# EAGLE schematic LabFriendMain1 (EAGLE 7.7.0), part 1 of 2

## Sheet 1 of 13: Config, Iso...
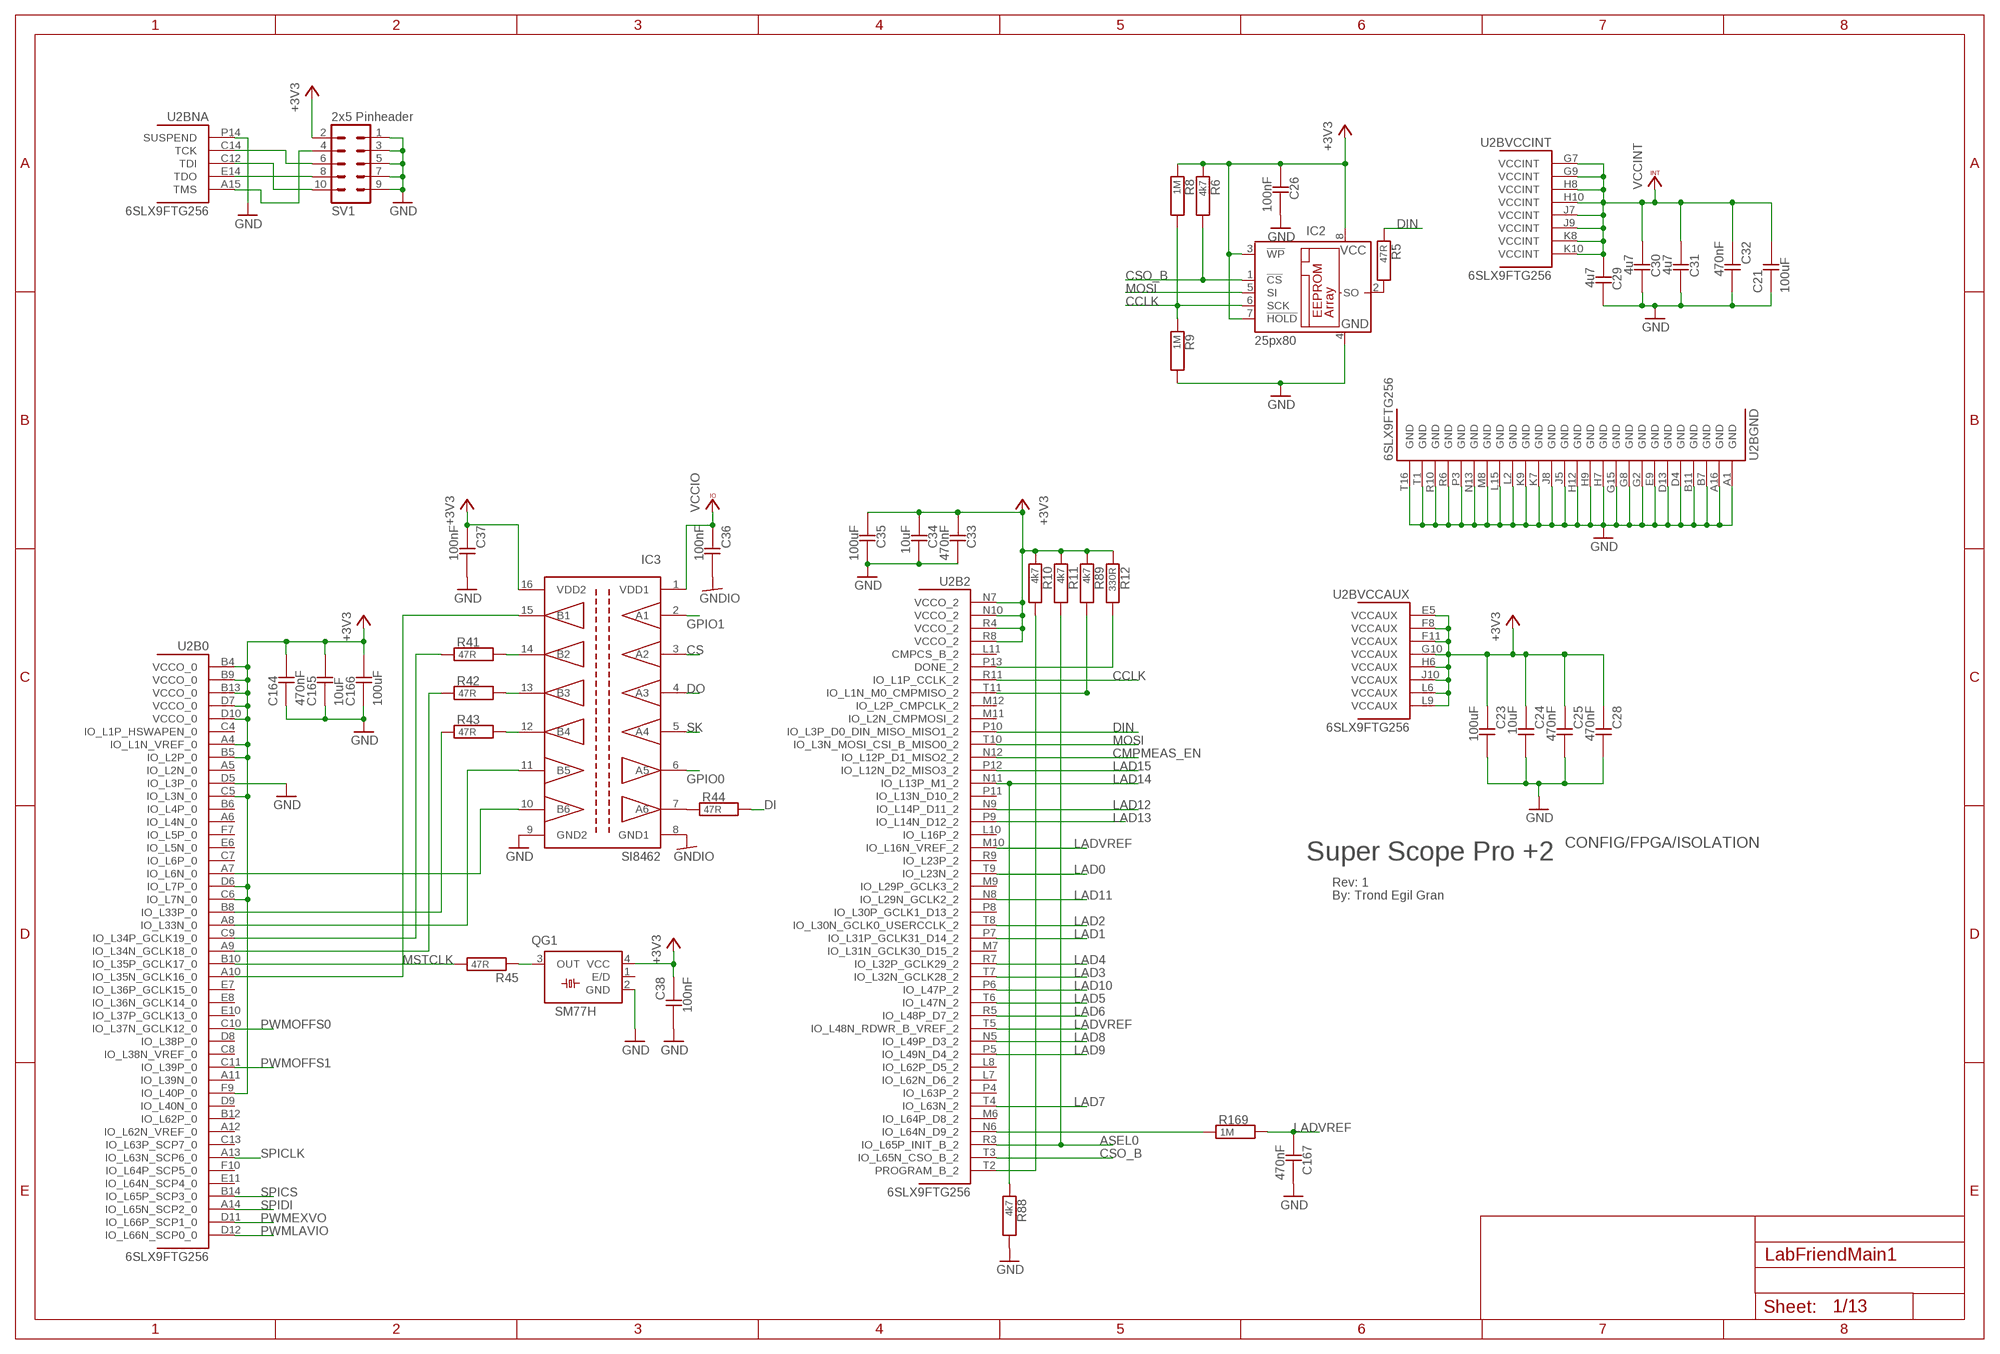
[diagram p0: schematic, sheet 1]

### Parts
C21  100uF  CAPC1206  [1206]
C23  100uF  CAPC1206  [1206]
C24  10uF  CAPC0603  [0603]
C25  470nF  CAPC0402  [0402]
C26  100nF  CAPC0402  [0402]
C28  470nF  CAPC0402  [0402]
C29  4u7  CAPC0603  [0603]
C30  4u7  CAPC0603  [0603]
C31  4u7  CAPC0603  [0603]
C32  470nF  CAPC0402  [0402]
C33  470nF  CAPC0402  [0402]
C34  10uF  CAPC0603  [0603]
C35  100uF  CAPC1206  [1206]
C36  100nF  CAPC0402  [0402]
C37  100nF  CAPC0402  [0402]
C38  100nF  CAPC0402  [0402]
C164  470nF  CAPC0402  [0402]
C165  10uF  CAPC0603  [0603]
C166  100uF  CAPC1206  [1206]
C167  470nF  CAPC0402  [0402]
IC2  25px80  25AA080SN  [SO-08]
IC3  SI8462  [SO16]
QG1  SM77H  [SM77H]
R5  47R  RESR0402  [0402]
R6  4k7  RESR0402  [0402]
R8  1M  RESR0402  [0402]
R9  1M  RESR0402  [0402]
R10  4k7  RESR0402  [0402]
R11  4k7  RESR0402  [0402]
R12  330R  RESR0402  [0402]
R41  47R  RESR0402  [0402]
R42  47R  RESR0402  [0402]
R43  47R  RESR0402  [0402]
R44  47R  RESR0402  [0402]
R45  47R  RESR0402  [0402]
R88  4k7  RESR0402  [0402]
R89  4k7  RESR0402  [0402]
R169  1M  RESR0402  [0402]
SV1  2x5 Pinheader  ML10  [ML10]
U2  6SLX9FTG256  [FT256]

### Nets
+3V3: C23.1 C24.1 C25.1 C26.1 C28.1 C33.1 C34.1 C35.1 C37.1 C38.1 C164.2 C165.2 C166.2 IC2.3(!WP) IC2.7(!HOLD) IC2.8(VCC) IC3.16(VDD2) QG1.4(VCC) R6.1 R8.1 R10.1 R11.1 R12.1 R89.1 SV1.2 U2.A4(B0:IO_L1N_VREF_0) U2.B4(B0:VCCO_0) U2.B5(B0:IO_L2P_0) U2.B9(B0:VCCO_0) U2.B13(B0:VCCO_0) U2.C5(B0:IO_L3N_0) U2.C6(B0:IO_L7N_0) U2.D6(B0:IO_L7P_0) U2.D7(B0:VCCO_0) U2.D10(B0:VCCO_0) U2.E5(BVCCAUX:VCCAUX) U2.F8(BVCCAUX:VCCAUX) U2.F9(B0:IO_L40P_0) U2.F11(BVCCAUX:VCCAUX) U2.G10(BVCCAUX:VCCAUX) U2.H6(BVCCAUX:VCCAUX) U2.J10(BVCCAUX:VCCAUX) U2.L6(BVCCAUX:VCCAUX) U2.L9(BVCCAUX:VCCAUX) U2.N7(B2:VCCO_2) U2.N10(B2:VCCO_2) U2.R4(B2:VCCO_2) U2.R8(B2:VCCO_2) ; also sheet 3,5,6,8
ASEL0: R11.2 U2.R3(B2:IO_L65P_INIT_B_2)
CCLK: IC2.6(SCK) R8.2 R9.1 U2.R11(B2:IO_L1P_CCLK_2)
CMPMEAS_EN: U2.N12(B2:IO_L12P_D1_MISO2_2) ; also sheet 9
CS: IC3.3(A2) ; also sheet 4
CSO_B: IC2.1(!CS) R6.2 U2.T3(B2:IO_L65N_CSO_B_2)
DI: R44.2 ; also sheet 4
DIN: R5.1 U2.P10(B2:IO_L3P_D0_DIN_MISO_MISO1_2)
DO: IC3.4(A3) ; also sheet 4
GND: C21.1 C23.2 C24.2 C25.2 C26.2 C28.2 C29.2 C30.2 C31.2 C32.2 C33.2 C34.2 C35.2 C37.2 C38.2 C164.1 C165.1 C166.1 C167.2 IC2.4(GND) IC3.9(GND2) QG1.2(GND) R9.2 R88.2 SV1.1 SV1.3 SV1.5 SV1.7 SV1.9 U2.A1(BGND:GND) U2.A16(BGND:GND) U2.B7(BGND:GND) U2.B11(BGND:GND) U2.D4(BGND:GND) U2.D5(B0:IO_L3P_0) U2.D13(BGND:GND) U2.E9(BGND:GND) U2.G2(BGND:GND) U2.G8(BGND:GND) U2.G15(BGND:GND) U2.H7(BGND:GND) U2.H9(BGND:GND) U2.H12(BGND:GND) U2.J5(BGND:GND) U2.J8(BGND:GND) U2.K7(BGND:GND) U2.K9(BGND:GND) U2.L2(BGND:GND) U2.L15(BGND:GND) U2.M8(BGND:GND) U2.N13(BGND:GND) U2.P3(BGND:GND) U2.P14(BNA:SUSPEND) U2.R6(BGND:GND) U2.R10(BGND:GND) U2.T1(BGND:GND) U2.T16(BGND:GND) ; also sheet 2,3,5,6,7,8,9,10,11,12,13
GNDIO: C36.2 IC3.8(GND1) ; also sheet 4,10
GPIO0: IC3.6(A5) ; also sheet 4
GPIO1: IC3.2(A1) ; also sheet 4
LAD0: U2.T9(B2:IO_L23N_2) ; also sheet 5
LAD1: U2.P7(B2:IO_L31P_GCLK31_D14_2) ; also sheet 5
LAD2: U2.T8(B2:IO_L30N_GCLK0_USERCCLK_2) ; also sheet 5
LAD3: U2.T7(B2:IO_L32N_GCLK28_2) ; also sheet 5
LAD4: U2.R7(B2:IO_L32P_GCLK29_2) ; also sheet 5
LAD5: U2.T6(B2:IO_L47N_2) ; also sheet 5
LAD6: U2.R5(B2:IO_L48P_D7_2) ; also sheet 5
LAD7: U2.T4(B2:IO_L63N_2) ; also sheet 5
LAD8: U2.N5(B2:IO_L49P_D3_2) ; also sheet 5
LAD9: U2.P5(B2:IO_L49N_D4_2) ; also sheet 5
LAD10: U2.P6(B2:IO_L47P_2) ; also sheet 5
LAD11: U2.N8(B2:IO_L29N_GCLK2_2) ; also sheet 5
LAD12: U2.N9(B2:IO_L14P_D11_2) ; also sheet 5
LAD13: U2.P9(B2:IO_L14N_D12_2) ; also sheet 5
LAD14: R88.1 U2.N11(B2:IO_L13P_M1_2) ; also sheet 5
LAD15: U2.P12(B2:IO_L12N_D2_MISO3_2) ; also sheet 5
LADVREF: C167.1 R169.2 U2.M10(B2:IO_L16N_VREF_2) U2.T5(B2:IO_L48N_RDWR_B_VREF_2)
MOSI: IC2.5(SI) U2.T10(B2:IO_L3N_MOSI_CSI_B_MISO0_2)
MSTCLK: R45.1 U2.B10(B0:IO_L35P_GCLK17_0)
N$1: IC3.14(B2) R41.2
N$2: IC2.2(SO) R5.2
N$3: R10.2 U2.T2(B2:PROGRAM_B_2)
N$5: R12.2 U2.P13(B2:DONE_2)
N$6: IC3.15(B1) U2.A10(B0:IO_L35N_GCLK16_0)
N$7: SV1.4 U2.A15(BNA:TMS)
N$8: SV1.6 U2.C14(BNA:TCK)
N$9: SV1.8 U2.E14(BNA:TDO)
N$10: SV1.10 U2.C12(BNA:TDI)
N$12: R41.1 U2.C9(B0:IO_L34P_GCLK19_0)
N$13: R42.1 U2.A9(B0:IO_L34N_GCLK18_0)
N$15: IC3.10(B6) U2.A7(B0:IO_L6N_0)
N$18: IC3.13(B3) R42.2
N$19: IC3.12(B4) R43.2
N$20: IC3.7(A6) R44.1
N$21: QG1.3(OUT) R45.2
N$90: IC3.11(B5) U2.A8(B0:IO_L33N_0)
N$205: R43.1 U2.B8(B0:IO_L33P_0)
N$210: R169.1 U2.N6(B2:IO_L64N_D9_2)
PULLUP1XA: R89.2 U2.T11(B2:IO_L1N_M0_CMPMISO_2)
PWMEXVO: U2.D11(B0:IO_L66P_SCP1_0) ; also sheet 7
PWMLAVIO: U2.D12(B0:IO_L66N_SCP0_0) ; also sheet 7
PWMOFFS0: U2.C10(B0:IO_L37N_GCLK12_0) ; also sheet 7
PWMOFFS1: U2.C11(B0:IO_L39P_0) ; also sheet 7
SK: IC3.5(A4) ; also sheet 4
SPICLK: U2.A13(B0:IO_L63N_SCP6_0) ; also sheet 11,12
SPICS: U2.B14(B0:IO_L65P_SCP3_0) ; also sheet 11,12
SPIDI: U2.A14(B0:IO_L65N_SCP2_0) ; also sheet 11
VCCINT: C21.2 C29.1 C30.1 C31.1 C32.1 U2.G7(BVCCINT:VCCINT) U2.G9(BVCCINT:VCCINT) U2.H8(BVCCINT:VCCINT) U2.H10(BVCCINT:VCCINT) U2.J7(BVCCINT:VCCINT) U2.J9(BVCCINT:VCCINT) U2.K8(BVCCINT:VCCINT) U2.K10(BVCCINT:VCCINT) ; also sheet 6
VCCIO: C36.1 IC3.1(VDD1) ; also sheet 4
Unconnected: QG1.1(E/D) U2.A5(B0:IO_L2N_0) U2.A6(B0:IO_L4N_0) U2.A11(B0:IO_L39N_0) U2.A12(B0:IO_L62N_VREF_0) U2.B6(B0:IO_L4P_0) U2.B12(B0:IO_L62P_0) U2.C4(B0:IO_L1P_HSWAPEN_0) U2.C7(B0:IO_L6P_0) U2.C8(B0:IO_L38N_VREF_0) U2.C13(B0:IO_L63P_SCP7_0) U2.D8(B0:IO_L38P_0) U2.D9(B0:IO_L40N_0) U2.E6(B0:IO_L5N_0) U2.E7(B0:IO_L36P_GCLK15_0) U2.E8(B0:IO_L36N_GCLK14_0) U2.E10(B0:IO_L37P_GCLK13_0) U2.E11(B0:IO_L64N_SCP4_0) U2.F7(B0:IO_L5P_0) U2.F10(B0:IO_L64P_SCP5_0) U2.L7(B2:IO_L62N_D6_2) U2.L8(B2:IO_L62P_D5_2) U2.L10(B2:IO_L16P_2) U2.L11(B2:CMPCS_B_2) U2.M6(B2:IO_L64P_D8_2) U2.M7(B2:IO_L31N_GCLK30_D15_2) U2.M9(B2:IO_L29P_GCLK3_2) U2.M11(B2:IO_L2N_CMPMOSI_2) U2.M12(B2:IO_L2P_CMPCLK_2) U2.P4(B2:IO_L63P_2) U2.P8(B2:IO_L30P_GCLK1_D13_2) U2.P11(B2:IO_L13N_D10_2) U2.R9(B2:IO_L23P_2)

### Notes on the sheet
- CONFIG/FPGA/ISOLATION
- Super Scope Pro +2
- Rev: 1
- By: Trond Egil Gran

## Sheet 2 of 13: DDR3 Memory
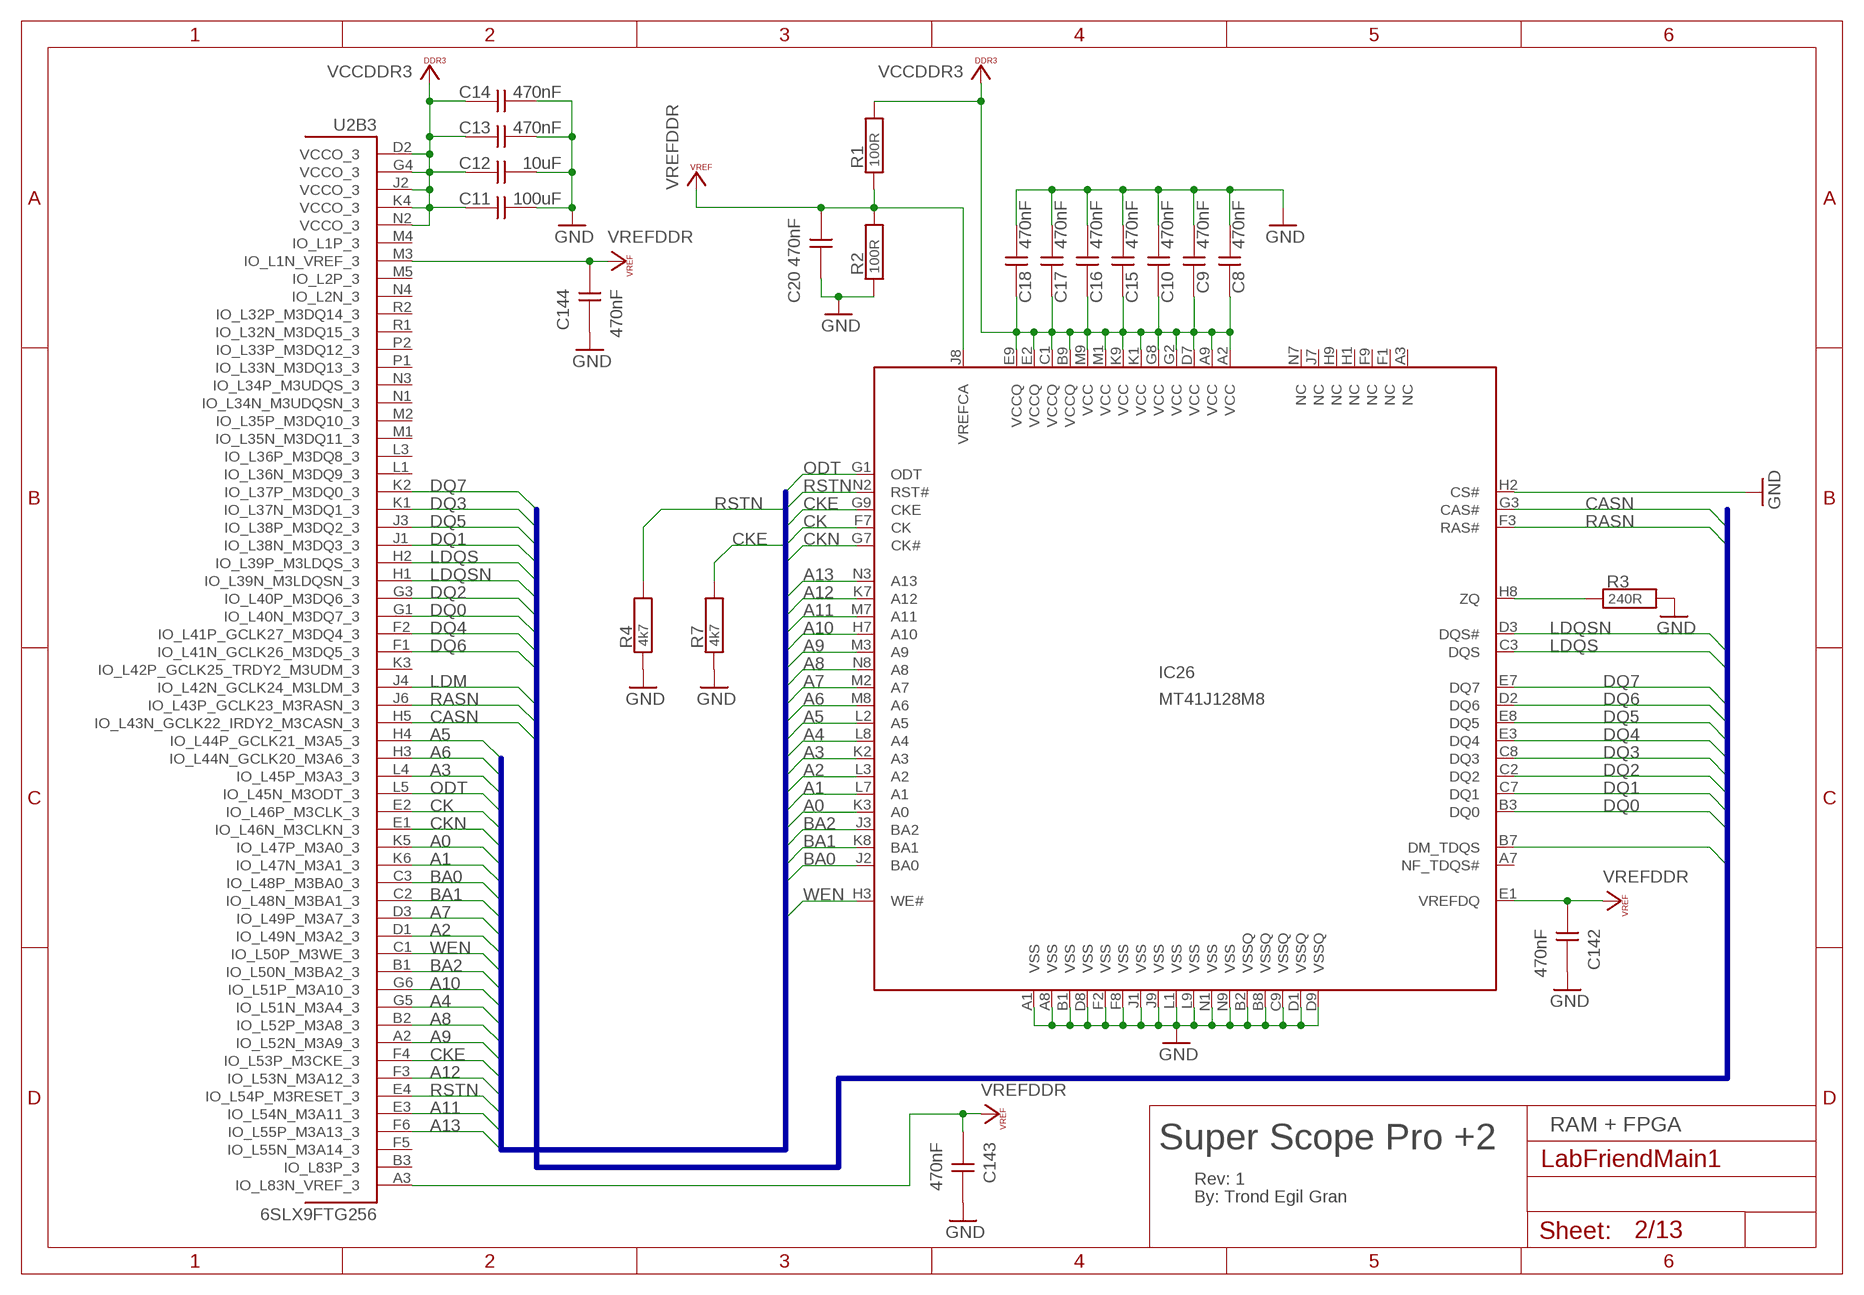
[diagram p1: schematic, sheet 2]

### Parts
C8  470nF  CAPC0402  [0402]
C9  470nF  CAPC0402  [0402]
C10  470nF  CAPC0402  [0402]
C11  100uF  CAPC1206  [1206]
C12  10uF  CAPC0603  [0603]
C13  470nF  CAPC0402  [0402]
C14  470nF  CAPC0402  [0402]
C15  470nF  CAPC0402  [0402]
C16  470nF  CAPC0402  [0402]
C17  470nF  CAPC0402  [0402]
C18  470nF  CAPC0402  [0402]
C20  470nF  CAPC0402  [0402]
C142  470nF  CAPC0402  [0402]
C143  470nF  CAPC0402  [0402]
C144  470nF  CAPC0402  [0402]
IC26  MT41J128M8  [FBGA78]
R1  100R  RESR0402  [0402]
R2  100R  RESR0402  [0402]
R3  240R  RESR0603  [0603]
R4  4k7  RESR0402  [0402]
R7  4k7  RESR0402  [0402]

### Nets
A0: IC26.K3(A0) U2.K5(B3:IO_L47P_M3A0_3)
A1: IC26.L7(A1) U2.K6(B3:IO_L47N_M3A1_3)
A2: IC26.L3(A2) U2.D1(B3:IO_L49N_M3A2_3)
A3: IC26.K2(A3) U2.L4(B3:IO_L45P_M3A3_3)
A4: IC26.L8(A4) U2.G5(B3:IO_L51N_M3A4_3)
A5: IC26.L2(A5) U2.H4(B3:IO_L44P_GCLK21_M3A5_3)
A6: IC26.M8(A6) U2.H3(B3:IO_L44N_GCLK20_M3A6_3)
A7: IC26.M2(A7) U2.D3(B3:IO_L49P_M3A7_3)
A8: IC26.N8(A8) U2.B2(B3:IO_L52P_M3A8_3)
A9: IC26.M3(A9) U2.A2(B3:IO_L52N_M3A9_3)
A10: IC26.H7(A10) U2.G6(B3:IO_L51P_M3A10_3)
A11: IC26.M7(A11) U2.E3(B3:IO_L54N_M3A11_3)
A12: IC26.K7(A12) U2.F3(B3:IO_L53N_M3A12_3)
A13: IC26.N3(A13) U2.F6(B3:IO_L55P_M3A13_3)
BA0: IC26.J2(BA0) U2.C3(B3:IO_L48P_M3BA0_3)
BA1: IC26.K8(BA1) U2.C2(B3:IO_L48N_M3BA1_3)
BA2: IC26.J3(BA2) U2.B1(B3:IO_L50N_M3BA2_3)
CASN: IC26.G3(CAS#) U2.H5(B3:IO_L43N_GCLK22_IRDY2_M3CASN_3)
CK: IC26.F7(CK) U2.E2(B3:IO_L46P_M3CLK_3)
CKE: IC26.G9(CKE) R7.2 U2.F4(B3:IO_L53P_M3CKE_3)
CKN: IC26.G7(CK#) U2.E1(B3:IO_L46N_M3CLKN_3)
DQ0: IC26.B3(DQ0) U2.G1(B3:IO_L40N_M3DQ7_3)
DQ1: IC26.C7(DQ1) U2.J1(B3:IO_L38N_M3DQ3_3)
DQ2: IC26.C2(DQ2) U2.G3(B3:IO_L40P_M3DQ6_3)
DQ3: IC26.C8(DQ3) U2.K1(B3:IO_L37N_M3DQ1_3)
DQ4: IC26.E3(DQ4) U2.F2(B3:IO_L41P_GCLK27_M3DQ4_3)
DQ5: IC26.E8(DQ5) U2.J3(B3:IO_L38P_M3DQ2_3)
DQ6: IC26.D2(DQ6) U2.F1(B3:IO_L41N_GCLK26_M3DQ5_3)
DQ7: IC26.E7(DQ7) U2.K2(B3:IO_L37P_M3DQ0_3)
GND: C8.2 C9.2 C10.2 C11.2 C12.2 C13.2 C14.2 C15.2 C16.2 C17.2 C18.2 C20.1 C142.1 C143.1 C144.1 IC26.A1(VSS) IC26.A8(VSS) IC26.B1(VSS) IC26.B2(VSSQ) IC26.B8(VSSQ) IC26.C9(VSSQ) IC26.D1(VSSQ) IC26.D8(VSS) IC26.D9(VSSQ) IC26.F2(VSS) IC26.F8(VSS) IC26.H2(CS#) IC26.J1(VSS) IC26.J9(VSS) IC26.L1(VSS) IC26.L9(VSS) IC26.N1(VSS) IC26.N9(VSS) R2.1 R3.2 R4.1 R7.1 ; also sheet 1,3,5,6,7,8,9,10,11,12,13
LDM: IC26.B7(DM_TDQS) U2.J4(B3:IO_L42N_GCLK24_M3LDM_3)
LDQS: IC26.C3(DQS) U2.H2(B3:IO_L39P_M3LDQS_3)
LDQSN: IC26.D3(DQS#) U2.H1(B3:IO_L39N_M3LDQSN_3)
N$149: IC26.H8(ZQ) R3.1
ODT: IC26.G1(ODT) U2.L5(B3:IO_L45N_M3ODT_3)
RASN: IC26.F3(RAS#) U2.J6(B3:IO_L43P_GCLK23_M3RASN_3)
RSTN: IC26.N2(RST#) R4.2 U2.E4(B3:IO_L54P_M3RESET_3)
VCCDDR3: C8.1 C9.1 C10.1 C11.1 C12.1 C13.1 C14.1 C15.1 C16.1 C17.1 C18.1 IC26.A2(VCC) IC26.A9(VCC) IC26.B9(VCCQ) IC26.C1(VCCQ) IC26.D7(VCC) IC26.E2(VCCQ) IC26.E9(VCCQ) IC26.G2(VCC) IC26.G8(VCC) IC26.K1(VCC) IC26.K9(VCC) IC26.M1(VCC) IC26.M9(VCC) R1.2 U2.D2(B3:VCCO_3) U2.G4(B3:VCCO_3) U2.J2(B3:VCCO_3) U2.K4(B3:VCCO_3) U2.N2(B3:VCCO_3) ; also sheet 6
VREFDDR: C20.2 C142.2 C143.2 C144.2 IC26.E1(VREFDQ) IC26.J8(VREFCA) R1.1 R2.2 U2.A3(B3:IO_L83N_VREF_3) U2.M3(B3:IO_L1N_VREF_3)
WEN: IC26.H3(WE#) U2.C1(B3:IO_L50P_M3WE_3)
Unconnected: IC26.A3(NC) IC26.A7(NF_TDQS#) IC26.F1(NC) IC26.F9(NC) IC26.H1(NC) IC26.H9(NC) IC26.J7(NC) IC26.N7(NC) U2.B3(B3:IO_L83P_3) U2.F5(B3:IO_L55N_M3A14_3) U2.K3(B3:IO_L42P_GCLK25_TRDY2_M3UDM_3) U2.L1(B3:IO_L36N_M3DQ9_3) U2.L3(B3:IO_L36P_M3DQ8_3) U2.M1(B3:IO_L35N_M3DQ11_3) U2.M2(B3:IO_L35P_M3DQ10_3) U2.M4(B3:IO_L1P_3) U2.M5(B3:IO_L2P_3) U2.N1(B3:IO_L34N_M3UDQSN_3) U2.N3(B3:IO_L34P_M3UDQS_3) U2.N4(B3:IO_L2N_3) U2.P1(B3:IO_L33N_M3DQ13_3) U2.P2(B3:IO_L33P_M3DQ12_3) U2.R1(B3:IO_L32N_M3DQ15_3) U2.R2(B3:IO_L32P_M3DQ14_3)

### Buses
A13,A12,A11,A10,A9,A8,A7,A6,A5,A4,A3,A2,A1,A0,BA2,BA1,BA0,CK,CKN,CKE,RSTN,ODT,WEN
CS#,CASN,RASN,UDM,LDM,DQ15,DQ14,DQ13,DQ12,DQ11,DQ10,DQ9,DQ8,DQ7,DQ6,DQ5,DQ4,DQ3,DQ2,DQ1,DQ0,UDQSN,UDQS,LDQSN,LDQS

### Notes on the sheet
- RAM + FPGA
- Super Scope Pro +2
- Rev: 1
- By: Trond Egil Gran

## Sheet 3 of 13: High Speed AD
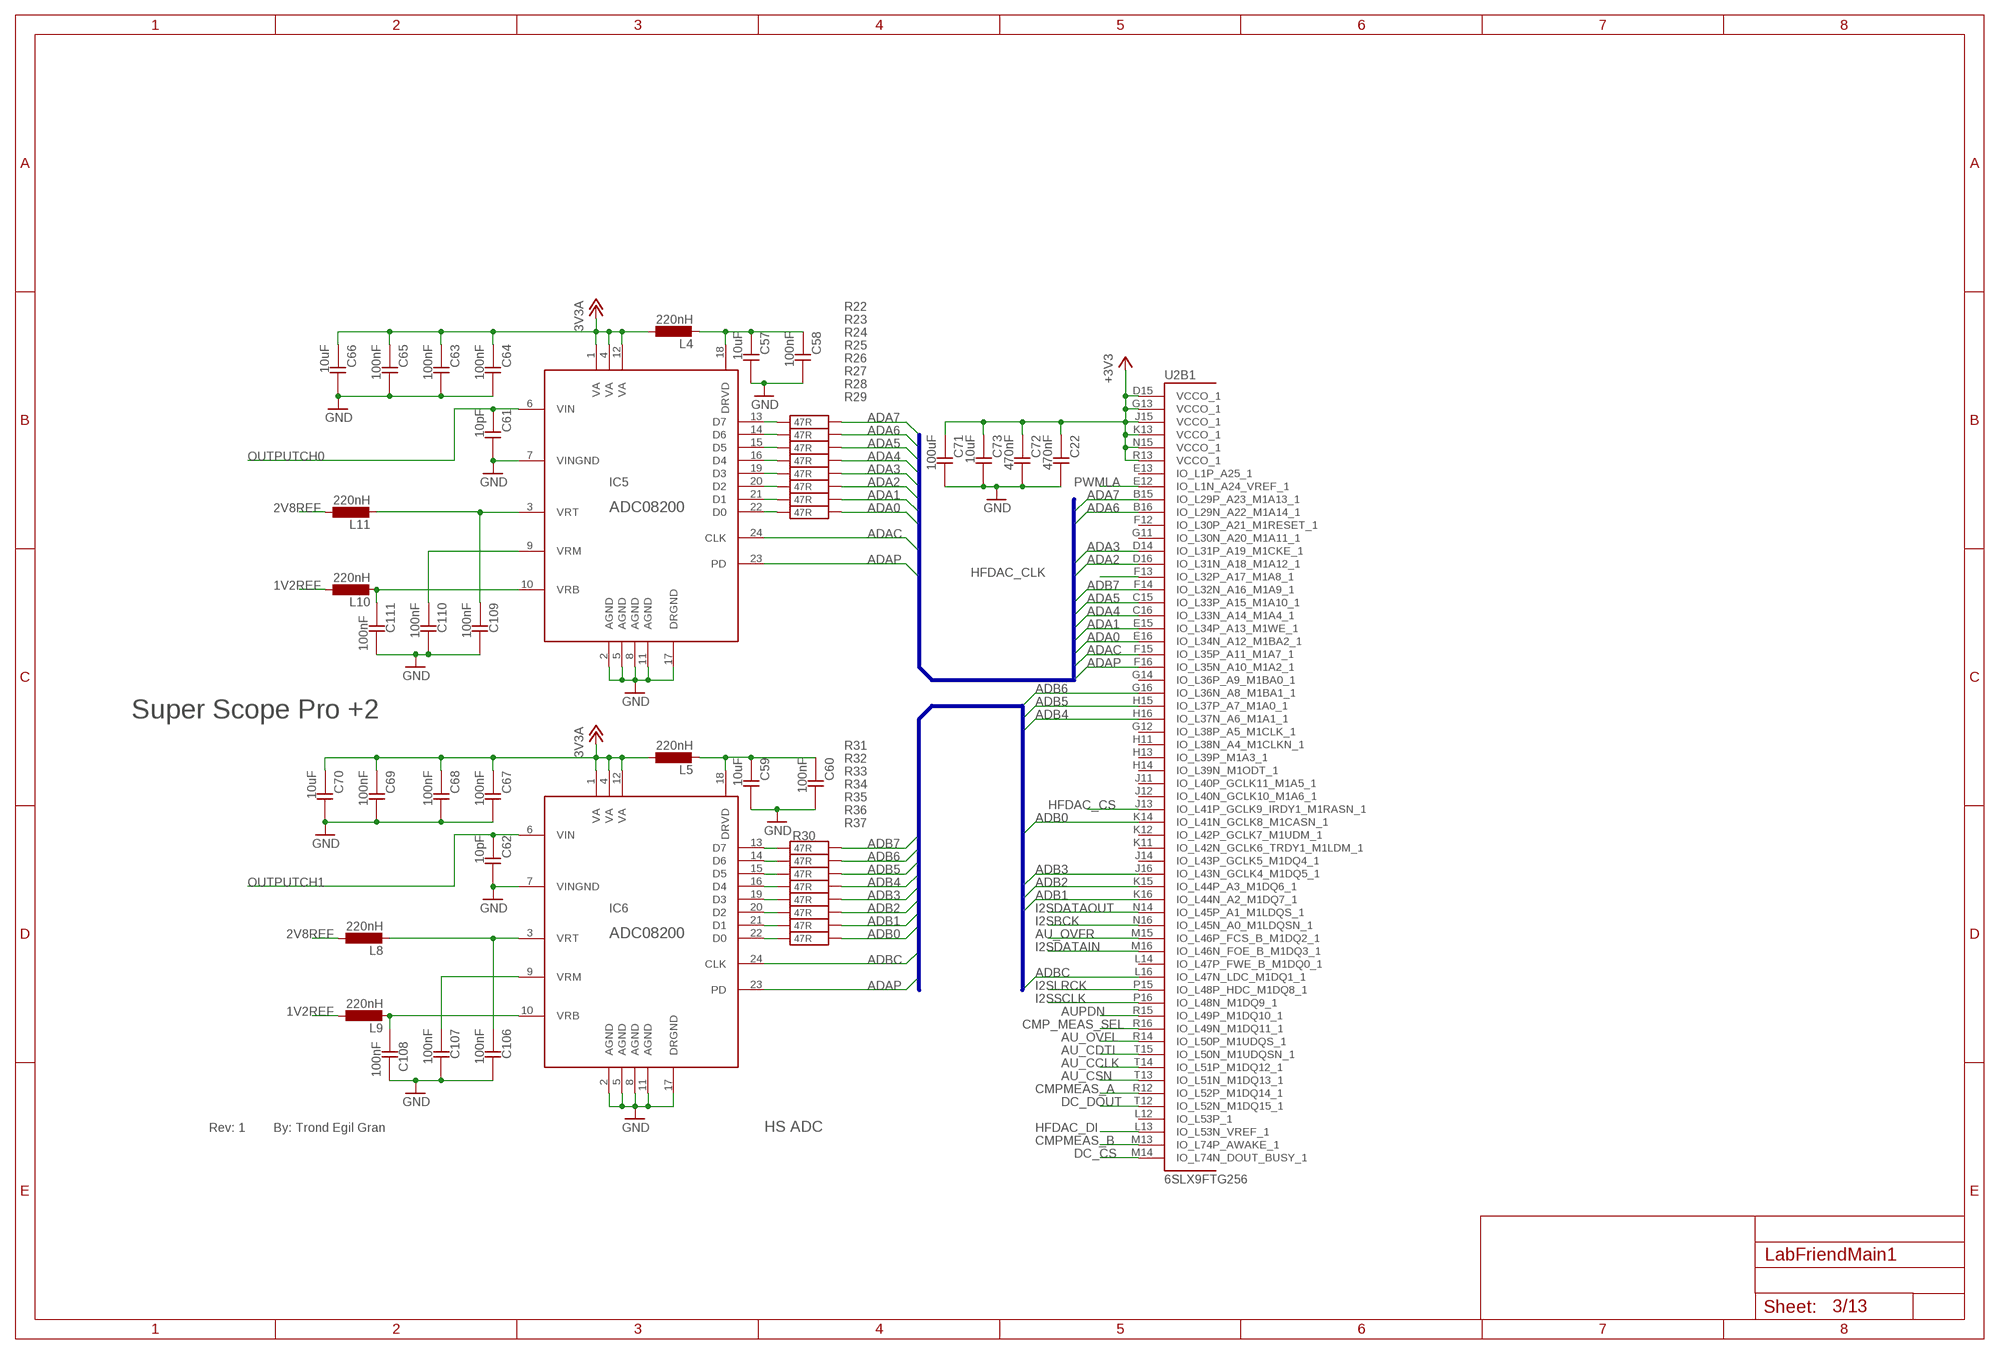
[diagram p2: schematic, sheet 3]

### Parts
C22  470nF  CAPC0402  [0402]
C57  10uF  CAPC0603  [0603]
C58  100nF  CAPC0402  [0402]
C59  10uF  CAPC0603  [0603]
C60  100nF  CAPC0402  [0402]
C61  10pF  CAPC0402  [0402]
C62  10pF  CAPC0402  [0402]
C63  100nF  CAPC0402  [0402]
C64  100nF  CAPC0402  [0402]
C65  100nF  CAPC0402  [0402]
C66  10uF  CAPC0603  [0603]
C67  100nF  CAPC0402  [0402]
C68  100nF  CAPC0402  [0402]
C69  100nF  CAPC0402  [0402]
C70  10uF  CAPC0603  [0603]
C71  100uF  CAPC1206  [1206]
C72  470nF  CAPC0402  [0402]
C73  10uF  CAPC0603  [0603]
C106  100nF  CAPC0402  [0402]
C107  100nF  CAPC0402  [0402]
C108  100nF  CAPC0402  [0402]
C109  100nF  CAPC0402  [0402]
C110  100nF  CAPC0402  [0402]
C111  100nF  CAPC0402  [0402]
IC5  ADC08200  [TSSOP24]
IC6  ADC08200  [TSSOP24]
L4  220nH  INUDCTOR0603  [0603]
L5  220nH  INUDCTOR0603  [0603]
L8  220nH  INUDCTOR0603  [0603]
L9  220nH  INUDCTOR0603  [0603]
L10  220nH  INUDCTOR0603  [0603]
L11  220nH  INUDCTOR0603  [0603]
R22  47R  RESR0402  [0402]
R23  47R  RESR0402  [0402]
R24  47R  RESR0402  [0402]
R25  47R  RESR0402  [0402]
R26  47R  RESR0402  [0402]
R27  47R  RESR0402  [0402]
R28  47R  RESR0402  [0402]
R29  47R  RESR0402  [0402]
R30  47R  RESR0402  [0402]
R31  47R  RESR0402  [0402]
R32  47R  RESR0402  [0402]
R33  47R  RESR0402  [0402]
R34  47R  RESR0402  [0402]
R35  47R  RESR0402  [0402]
R36  47R  RESR0402  [0402]
R37  47R  RESR0402  [0402]

### Nets
1V2REF: L9.1 L10.1 ; also sheet 7
1V2REFAD0: C111.1 IC5.10(VRB) L10.2
1V2REFAD1: C108.1 IC6.10(VRB) L9.2
2V8REF: L8.1 L11.1 ; also sheet 7
2V8REFAD0: C109.1 IC5.3(VRT) L11.2
2V8REFAD1: C106.1 IC6.3(VRT) L8.2
3V3A: C63.1 C64.1 C65.1 C66.1 C67.1 C68.1 C69.1 C70.1 IC5.1(VA) IC5.4(VA) IC5.12(VA) IC6.1(VA) IC6.4(VA) IC6.12(VA) L4.1 L5.1 ; also sheet 6,7,11,12
+3V3: C22.1 C71.1 C72.1 C73.1 U2.D15(B1:VCCO_1) U2.G13(B1:VCCO_1) U2.J15(B1:VCCO_1) U2.K13(B1:VCCO_1) U2.N15(B1:VCCO_1) U2.R13(B1:VCCO_1) ; also sheet 1,5,6,8
ADA0: R29.2 U2.E16(B1:IO_L34N_A12_M1BA2_1)
ADA1: R28.2 U2.E15(B1:IO_L34P_A13_M1WE_1)
ADA2: R27.2 U2.D16(B1:IO_L31N_A18_M1A12_1)
ADA3: R26.2 U2.D14(B1:IO_L31P_A19_M1CKE_1)
ADA4: R25.2 U2.C16(B1:IO_L33N_A14_M1A4_1)
ADA5: R24.2 U2.C15(B1:IO_L33P_A15_M1A10_1)
ADA6: R23.2 U2.B16(B1:IO_L29N_A22_M1A14_1)
ADA7: R22.2 U2.B15(B1:IO_L29P_A23_M1A13_1)
ADAC: IC5.24(CLK) U2.F15(B1:IO_L35P_A11_M1A7_1)
ADAP: IC5.23(PD) IC6.23(PD) U2.F16(B1:IO_L35N_A10_M1A2_1)
ADB0: R37.2 U2.K14(B1:IO_L41N_GCLK8_M1CASN_1)
ADB1: R36.2 U2.K16(B1:IO_L44N_A2_M1DQ7_1)
ADB2: R35.2 U2.K15(B1:IO_L44P_A3_M1DQ6_1)
ADB3: R34.2 U2.J16(B1:IO_L43N_GCLK4_M1DQ5_1)
ADB4: R33.2 U2.H16(B1:IO_L37N_A6_M1A1_1)
ADB5: R32.2 U2.H15(B1:IO_L37P_A7_M1A0_1)
ADB6: R31.2 U2.G16(B1:IO_L36N_A8_M1BA1_1)
ADB7: R30.2 U2.F14(B1:IO_L32N_A16_M1A9_1)
ADBC: IC6.24(CLK) U2.L16(B1:IO_L47N_LDC_M1DQ1_1)
AU_CCLK: U2.T14(B1:IO_L51P_M1DQ12_1) ; also sheet 8,9
AU_CDTI: U2.T15(B1:IO_L50N_M1UDQSN_1) ; also sheet 8,9
AU_CSN: U2.T13(B1:IO_L51N_M1DQ13_1) ; also sheet 8
AU_OVFL: U2.R14(B1:IO_L50P_M1UDQS_1) ; also sheet 8
AU_OVFR: U2.M15(B1:IO_L46P_FCS_B_M1DQ2_1) ; also sheet 8
AUPDN: U2.R15(B1:IO_L49P_M1DQ10_1) ; also sheet 8
CMP_MEAS_SEL: U2.R16(B1:IO_L49N_M1DQ11_1) ; also sheet 8
CMPMEAS_A: U2.R12(B1:IO_L52P_M1DQ14_1) ; also sheet 9
CMPMEAS_B: U2.M13(B1:IO_L74P_AWAKE_1) ; also sheet 9
DC_CS: U2.M14(B1:IO_L74N_DOUT_BUSY_1) ; also sheet 9
DC_DOUT: U2.T12(B1:IO_L52N_M1DQ15_1) ; also sheet 9
GND: C22.2 C57.2 C58.2 C59.2 C60.2 C61.2 C62.2 C63.2 C64.2 C65.2 C66.2 C67.2 C68.2 C69.2 C70.2 C71.2 C72.2 C73.2 C106.2 C107.2 C108.2 C109.2 C110.2 C111.2 IC5.2(AGND) IC5.5(AGND) IC5.7(VINGND) IC5.8(AGND) IC5.11(AGND) IC5.17(DRGND) IC6.2(AGND) IC6.5(AGND) IC6.7(VINGND) IC6.8(AGND) IC6.11(AGND) IC6.17(DRGND) ; also sheet 1,2,5,6,7,8,9,10,11,12,13
HFDAC_CLK: U2.F13(B1:IO_L32P_A17_M1A8_1) ; also sheet 13
HFDAC_CS: U2.J13(B1:IO_L41P_GCLK9_IRDY1_M1RASN_1) ; also sheet 13
HFDAC_DI: U2.L13(B1:IO_L53N_VREF_1) ; also sheet 13
I2SBCK: U2.N16(B1:IO_L45N_A0_M1LDQSN_1) ; also sheet 8
I2SDATAIN: U2.M16(B1:IO_L46N_FOE_B_M1DQ3_1) ; also sheet 8
I2SDATAOUT: U2.N14(B1:IO_L45P_A1_M1LDQS_1) ; also sheet 8
I2SLRCK: U2.P15(B1:IO_L48P_HDC_M1DQ8_1) ; also sheet 8
I2SSCLK: U2.P16(B1:IO_L48N_M1DQ9_1) ; also sheet 8
N$42: C57.1 C58.1 IC5.18(DRVD) L4.2
N$44: IC5.13(D7) R22.1
N$45: C59.1 C60.1 IC6.18(DRVD) L5.2
N$46: IC5.14(D6) R23.1
N$47: IC5.15(D5) R24.1
N$48: IC5.16(D4) R25.1
N$49: IC5.19(D3) R26.1
N$50: IC5.20(D2) R27.1
N$51: IC5.21(D1) R28.1
N$52: IC5.22(D0) R29.1
N$53: IC6.13(D7) R30.1
N$54: IC6.14(D6) R31.1
N$55: IC6.15(D5) R32.1
N$56: IC6.16(D4) R33.1
N$57: IC6.19(D3) R34.1
N$58: IC6.20(D2) R35.1
N$59: IC6.21(D1) R36.1
N$60: IC6.22(D0) R37.1
NONO1: C110.1 IC5.9(VRM)
NONO2: C107.1 IC6.9(VRM)
OUTPUTCH0: C61.1 IC5.6(VIN) ; also sheet 12
OUTPUTCH1: C62.1 IC6.6(VIN) ; also sheet 11
PWMLA: U2.E12(B1:IO_L1N_A24_VREF_1) ; also sheet 7
Unconnected: U2.E13(B1:IO_L1P_A25_1) U2.F12(B1:IO_L30P_A21_M1RESET_1) U2.G11(B1:IO_L30N_A20_M1A11_1) U2.G12(B1:IO_L38P_A5_M1CLK_1) U2.G14(B1:IO_L36P_A9_M1BA0_1) U2.H11(B1:IO_L38N_A4_M1CLKN_1) U2.H13(B1:IO_L39P_M1A3_1) U2.H14(B1:IO_L39N_M1ODT_1) U2.J11(B1:IO_L40P_GCLK11_M1A5_1) U2.J12(B1:IO_L40N_GCLK10_M1A6_1) U2.J14(B1:IO_L43P_GCLK5_M1DQ4_1) U2.K11(B1:IO_L42N_GCLK6_TRDY1_M1LDM_1) U2.K12(B1:IO_L42P_GCLK7_M1UDM_1) U2.L12(B1:IO_L53P_1) U2.L14(B1:IO_L47P_FWE_B_M1DQ0_1)

### Buses
ADA0,ADA1,ADA2,ADA3,ADA4,ADA5,ADA6,ADA7,ADAC,ADAP,ADB7
ADB0,ADB1,ADB2,ADB3,ADB4,ADB5,ADB6,ADB7,ADBC,ADAP

### Notes on the sheet
- Super Scope Pro +2
- Rev: 1 | By: Trond Egil Gran | HS ADC

## Sheet 4 of 13: USB Input
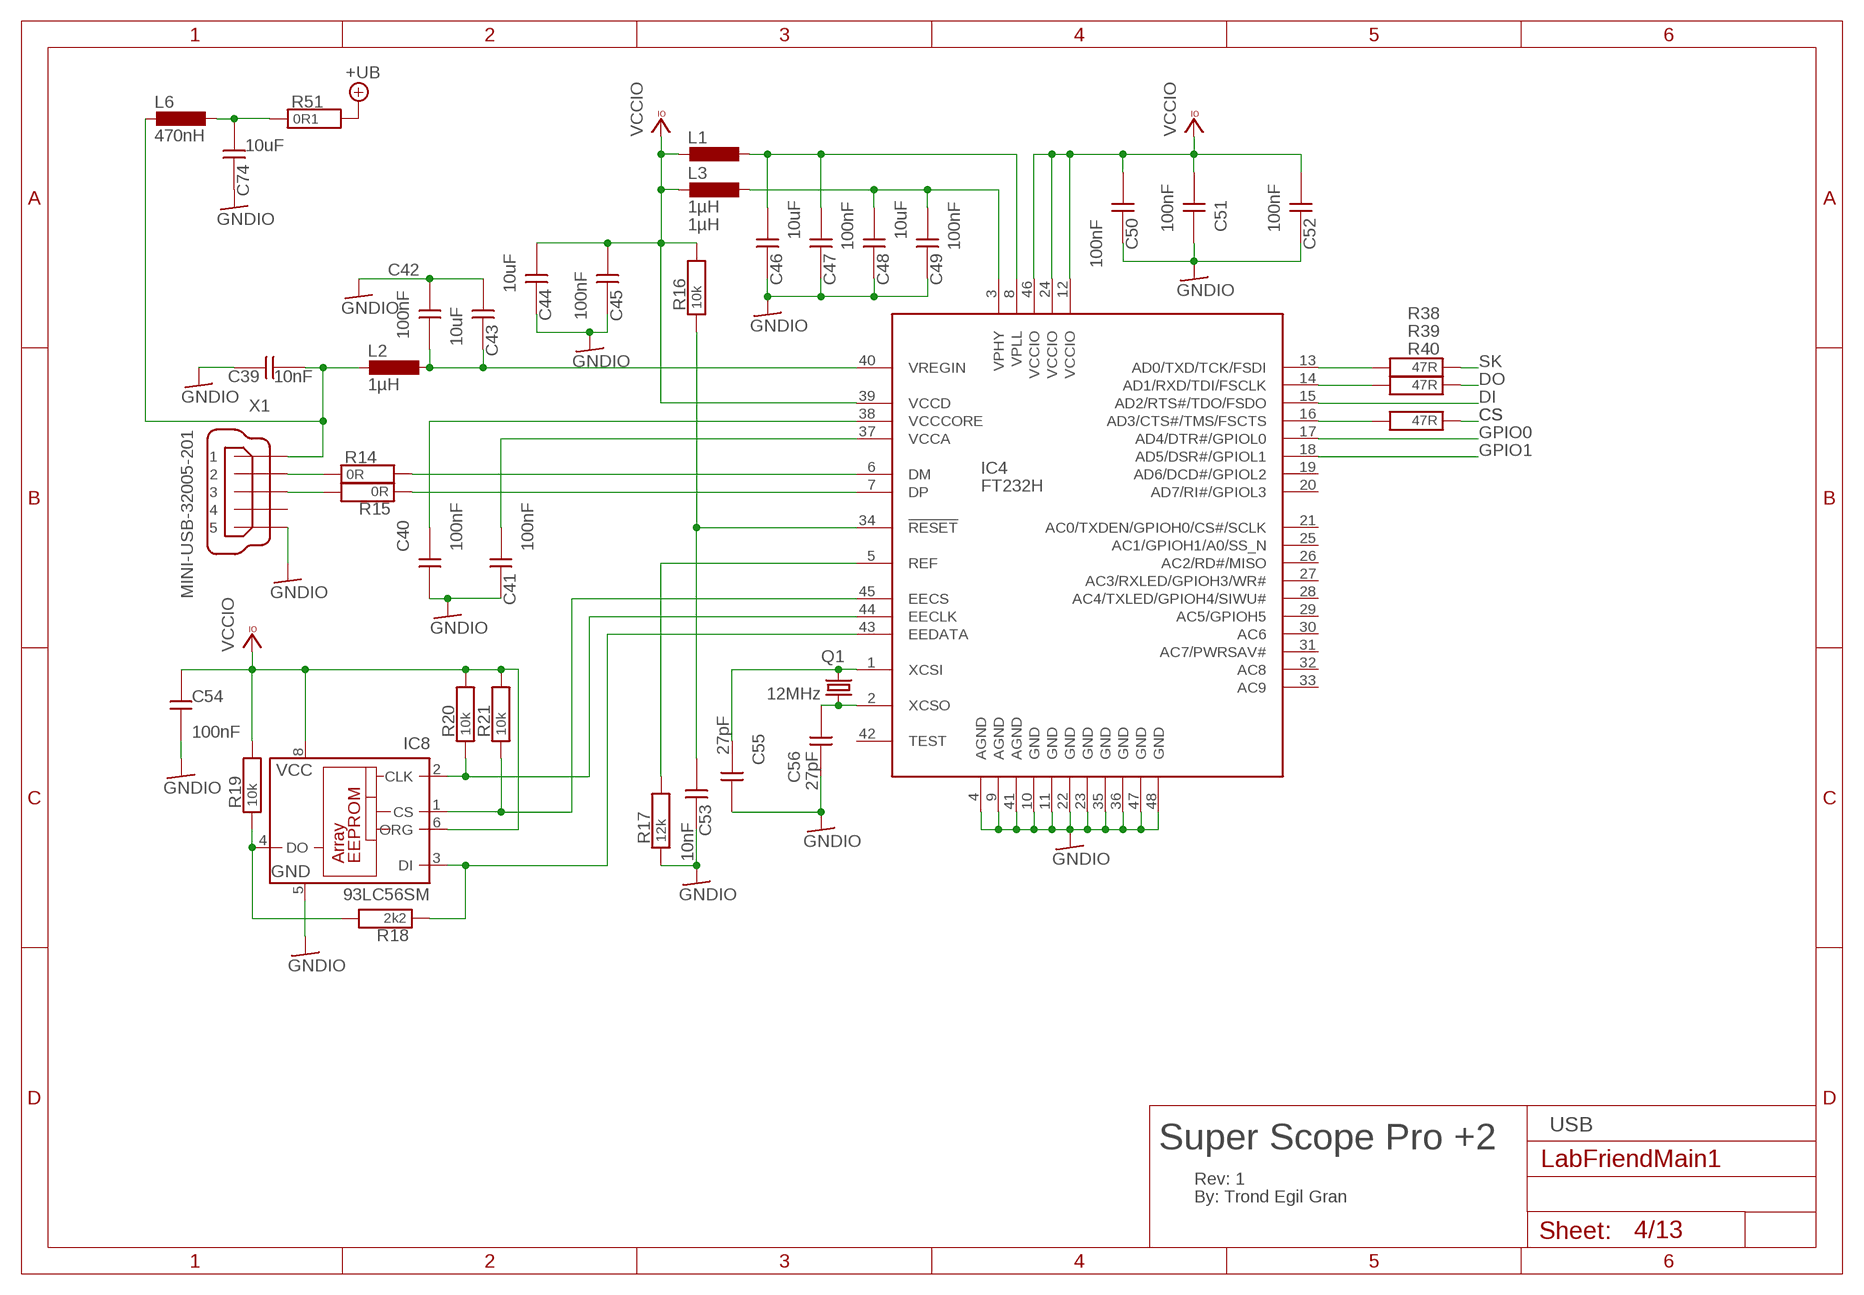
[diagram p3: schematic, sheet 4]

### Parts
C39  10nF  CAPC0402  [0402]
C40  100nF  CAPC0402  [0402]
C41  100nF  CAPC0402  [0402]
C42  100nF  CAPC0402  [0402]
C43  10uF  CAPC0603  [0603]
C44  10uF  CAPC0603  [0603]
C45  100nF  CAPC0402  [0402]
C46  10uF  CAPC0603  [0603]
C47  100nF  CAPC0402  [0402]
C48  10uF  CAPC0603  [0603]
C49  100nF  CAPC0402  [0402]
C50  100nF  CAPC0402  [0402]
C51  100nF  CAPC0402  [0402]
C52  100nF  CAPC0402  [0402]
C53  10nF  CAPC0402  [0402]
C54  100nF  CAPC0402  [0402]
C55  27pF  CAPC0603  [0603]
C56  27pF  CAPC0603  [0603]
C74  10uF  CAPC0603  [0603]
IC4  FT232H  [LQFP48]
IC8  93LC56SM  [SO-08M]
L1  1µH  L-EUL3216C  [L3216C]
L2  1µH  L-EUL3216C  [L3216C]
L3  1µH  L-EUL3216C  [L3216C]
L6  470nH  L-EUL3216C  [L3216C]
Q1  12MHz  CRYSTALHC49UP  [HC49UP]
R14  0R  RESR0603  [0603]
R15  0R  RESR0603  [0603]
R16  10k  RESR0603  [0603]
R17  12k  RESR0603  [0603]
R18  2k2  RESR0402  [0402]
R19  10k  RESR0603  [0603]
R20  10k  RESR0603  [0603]
R21  10k  RESR0603  [0603]
R38  47R  RESR0402  [0402]
R39  47R  RESR0402  [0402]
R40  47R  RESR0402  [0402]
R51  0R1  RESR0603  [0603]
X1  MINI-USB-32005-201  [32005-201]

### Nets
+UB: R51.2 ; also sheet 10
CS: R40.1 ; also sheet 1
DI: IC4.15(AD2/RTS#/TDO/FSDO) ; also sheet 1
DO: R39.1 ; also sheet 1
GNDIO: C39.2 C40.2 C41.2 C42.1 C43.1 C44.2 C45.2 C46.2 C47.2 C48.2 C49.2 C50.2 C51.2 C52.2 C53.2 C54.2 C55.1 C56.1 C74.2 IC4.4(AGND) IC4.9(AGND) IC4.10(GND) IC4.11(GND) IC4.22(GND) IC4.23(GND) IC4.35(GND) IC4.36(GND) IC4.41(AGND) IC4.47(GND) IC4.48(GND) IC8.5(GND) R17.1 X1.5 ; also sheet 1,10
GPIO0: IC4.17(AD4/DTR#/GPIOL0) ; also sheet 1
GPIO1: IC4.18(AD5/DSR#/GPIOL1) ; also sheet 1
N$16: IC4.13(AD0/TXD/TCK/FSDI) R38.2
N$17: R14.1 X1.2
N$22: C39.1 L2.2 L6.2 X1.1
N$24: C42.2 C43.2 IC4.40(VREGIN) L2.1
N$25: IC4.6(DM) R14.2
N$26: IC4.7(DP) R15.1
N$27: R15.2 X1.3
N$29: C41.1 IC4.37(VCCA)
N$30: C40.1 IC4.38(VCCCORE)
N$31: C53.1 IC4.34(!RESET) R16.1
N$32: C46.1 C47.1 IC4.8(VPLL) L1.1
N$33: C48.1 C49.1 IC4.3(VPHY) L3.1
N$34: IC4.5(REF) R17.2
N$35: IC8.4(DO) R18.2 R19.1
N$36: IC4.43(EEDATA) IC8.3(DI) R18.1
N$37: C56.2 IC4.2(XCSO) Q1.1
N$38: IC4.44(EECLK) IC8.2(CLK) R20.1
N$39: IC4.45(EECS) IC8.1(CS) R21.1
N$40: C55.2 IC4.1(XCSI) Q1.2
N$62: IC4.14(AD1/RXD/TDI/FSCLK) R39.2
N$64: IC4.16(AD3/CTS#/TMS/FSCTS) R40.2
N$89: C74.1 L6.1 R51.1
SK: R38.1 ; also sheet 1
VCCIO: C44.1 C45.1 C50.1 C51.1 C52.1 C54.1 IC4.12(VCCIO) IC4.24(VCCIO) IC4.39(VCCD) IC4.46(VCCIO) IC8.6(ORG) IC8.8(VCC) L1.2 L3.2 R16.2 R19.2 R20.2 R21.2 ; also sheet 1
Unconnected: IC4.19(AD6/DCD#/GPIOL2) IC4.20(AD7/RI#/GPIOL3) IC4.21(AC0/TXDEN/GPIOH0/CS#/SCLK) IC4.25(AC1/GPIOH1/A0/SS_N) IC4.26(AC2/RD#/MISO) IC4.27(AC3/RXLED/GPIOH3/WR#) IC4.28(AC4/TXLED/GPIOH4/SIWU#) IC4.29(AC5/GPIOH5) IC4.30(AC6) IC4.31(AC7/PWRSAV#) IC4.32(AC8) IC4.33(AC9) IC4.42(TEST) IC8.7(NU) X1.4

### Notes on the sheet
- USB
- Super Scope Pro +2
- Rev: 1
- By: Trond Egil Gran

## Sheet 5 of 13: Logic Analyzer
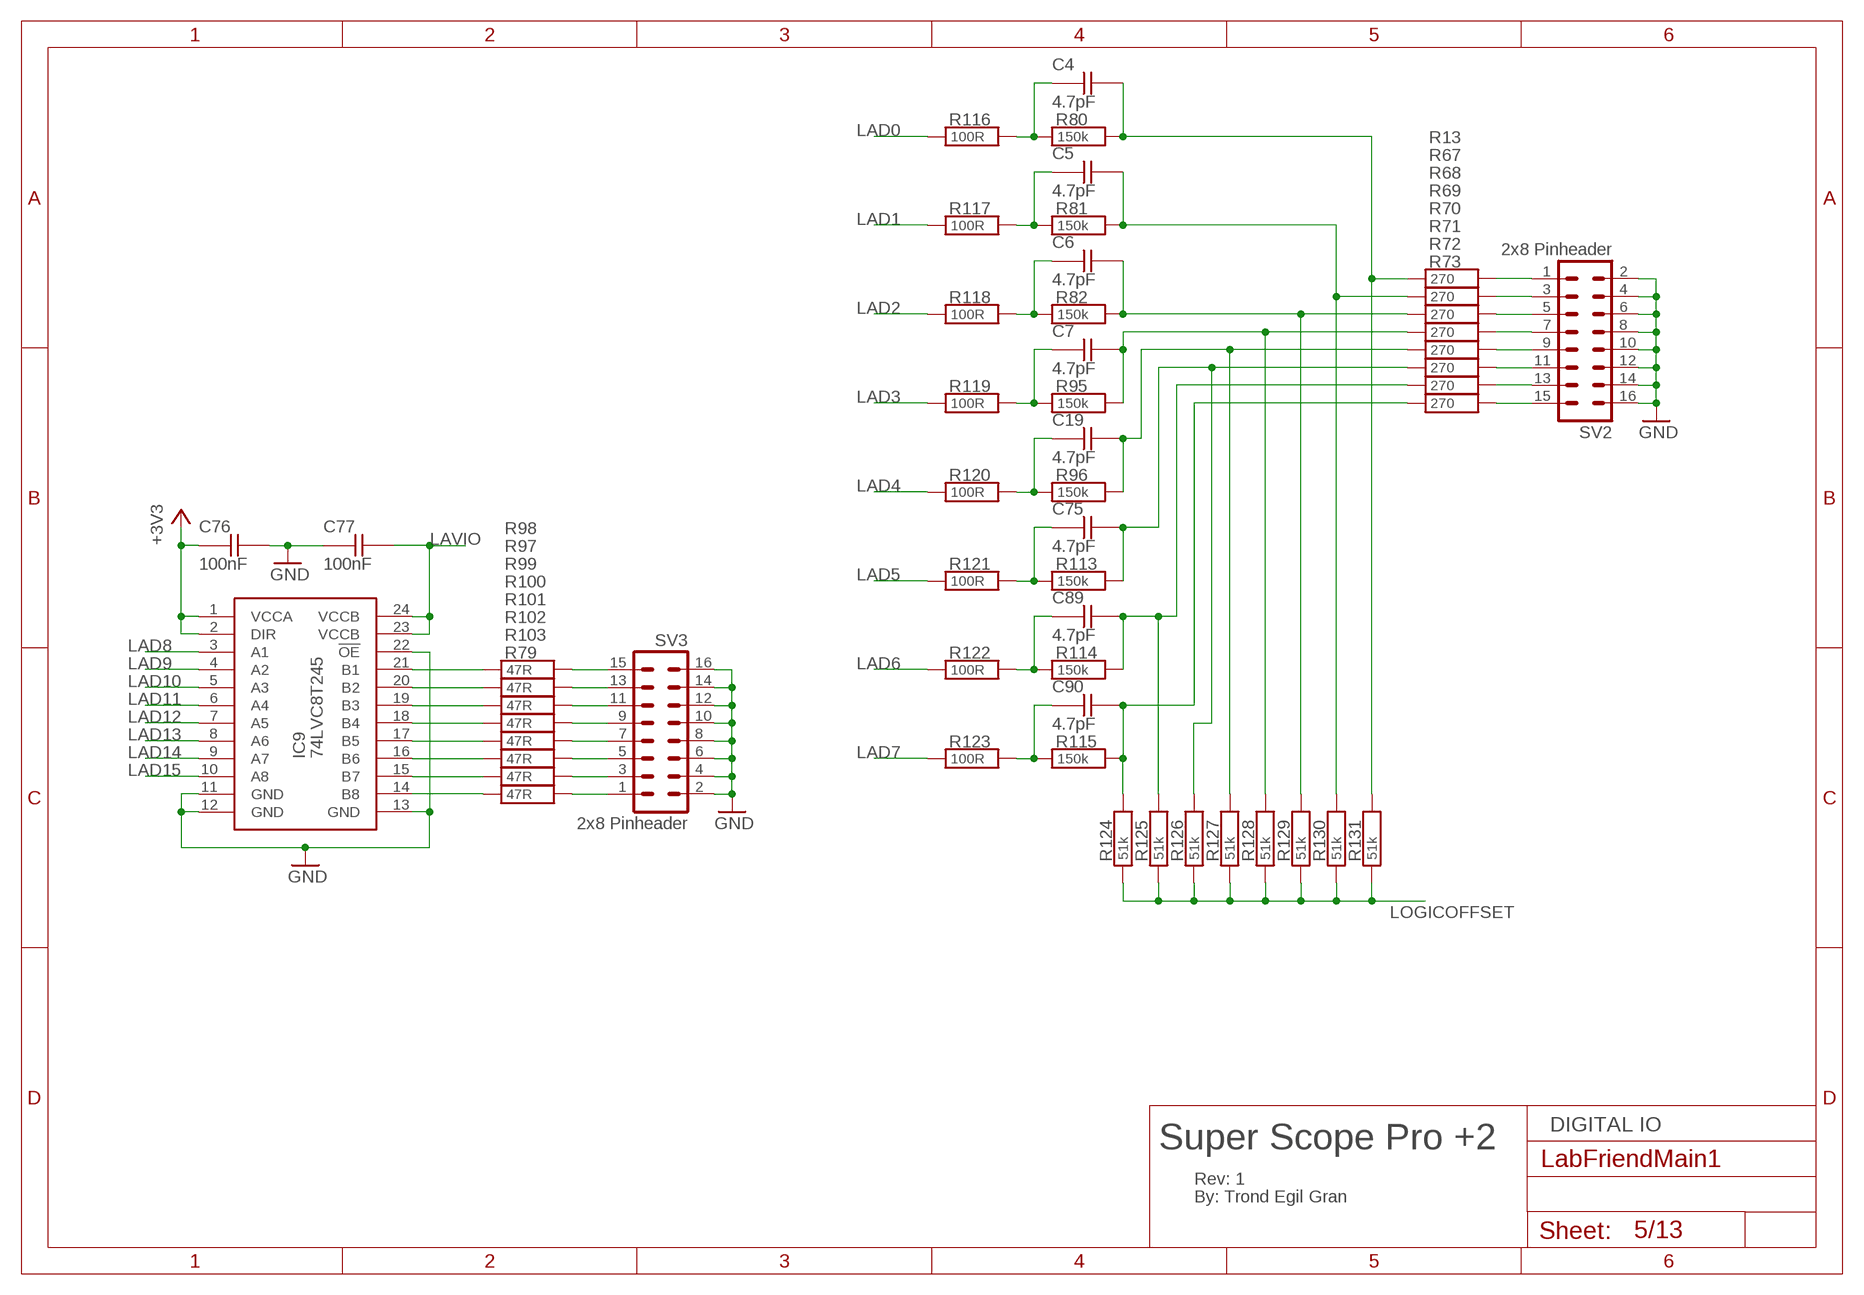
[diagram p4: schematic, sheet 5]

### Parts
C4  4.7pF  CAPC0402  [0402]
C5  4.7pF  CAPC0402  [0402]
C6  4.7pF  CAPC0402  [0402]
C7  4.7pF  CAPC0402  [0402]
C19  4.7pF  CAPC0402  [0402]
C75  4.7pF  CAPC0402  [0402]
C76  100nF  CAPC0402  [0402]
C77  100nF  CAPC0402  [0402]
C89  4.7pF  CAPC0402  [0402]
C90  4.7pF  CAPC0402  [0402]
IC9  74LVC8T245  [R-PDSO-G24]
R13  270  RESR0402  [0402]
R67  270  RESR0402  [0402]
R68  270  RESR0402  [0402]
R69  270  RESR0402  [0402]
R70  270  RESR0402  [0402]
R71  270  RESR0402  [0402]
R72  270  RESR0402  [0402]
R73  270  RESR0402  [0402]
R79  47R  RESR0402  [0402]
R80  150k  RESR0402  [0402]
R81  150k  RESR0402  [0402]
R82  150k  RESR0402  [0402]
R95  150k  RESR0402  [0402]
R96  150k  RESR0402  [0402]
R97  47R  RESR0402  [0402]
R98  47R  RESR0402  [0402]
R99  47R  RESR0402  [0402]
R100  47R  RESR0402  [0402]
R101  47R  RESR0402  [0402]
R102  47R  RESR0402  [0402]
R103  47R  RESR0402  [0402]
R113  150k  RESR0402  [0402]
R114  150k  RESR0402  [0402]
R115  150k  RESR0402  [0402]
R116  100R  RESR0402  [0402]
R117  100R  RESR0402  [0402]
R118  100R  RESR0402  [0402]
R119  100R  RESR0402  [0402]
R120  100R  RESR0402  [0402]
R121  100R  RESR0402  [0402]
R122  100R  RESR0402  [0402]
R123  100R  RESR0402  [0402]
R124  51k  RESR0402  [0402]
R125  51k  RESR0402  [0402]
R126  51k  RESR0402  [0402]
R127  51k  RESR0402  [0402]
R128  51k  RESR0402  [0402]
R129  51k  RESR0402  [0402]
R130  51k  RESR0402  [0402]
R131  51k  RESR0402  [0402]
SV2  2x8 Pinheader  MA08-2W  [MA08-2W]
SV3  2x8 Pinheader  MA08-2W  [MA08-2W]

### Nets
+3V3: C76.1 IC9.1(VCCA) IC9.2(DIR) ; also sheet 1,3,6,8
GND: C76.2 C77.1 IC9.11(GND) IC9.12(GND) IC9.13(GND) IC9.22(!OE) SV2.2 SV2.4 SV2.6 SV2.8 SV2.10 SV2.12 SV2.14 SV2.16 SV3.2 SV3.4 SV3.6 SV3.8 SV3.10 SV3.12 SV3.14 SV3.16 ; also sheet 1,2,3,6,7,8,9,10,11,12,13
LAD0: R116.1 ; also sheet 1
LAD1: R117.1 ; also sheet 1
LAD2: R118.1 ; also sheet 1
LAD3: R119.1 ; also sheet 1
LAD4: R120.1 ; also sheet 1
LAD5: R121.1 ; also sheet 1
LAD6: R122.1 ; also sheet 1
LAD7: R123.1 ; also sheet 1
LAD8: IC9.3(A1) ; also sheet 1
LAD9: IC9.4(A2) ; also sheet 1
LAD10: IC9.5(A3) ; also sheet 1
LAD11: IC9.6(A4) ; also sheet 1
LAD12: IC9.7(A5) ; also sheet 1
LAD13: IC9.8(A6) ; also sheet 1
LAD14: IC9.9(A7) ; also sheet 1
LAD15: IC9.10(A8) ; also sheet 1
LAVIO: C77.2 IC9.23(VCCB) IC9.24(VCCB) ; also sheet 7
LOGICOFFSET: R124.1 R125.1 R126.1 R127.1 R128.1 R129.1 R130.1 R131.1 ; also sheet 7
N$28: IC9.14(B8) R79.1
N$41: R13.2 SV2.1
N$43: R67.2 SV2.3
N$61: C4.2 R13.1 R80.2 R131.2
N$63: C5.2 R67.1 R81.2 R130.2
N$68: C6.2 R68.1 R82.2 R129.2
N$69: C7.2 R69.1 R95.2 R128.2
N$70: C19.2 R70.1 R96.2 R127.2
N$71: C75.2 R71.1 R113.2 R126.2
N$72: C89.2 R72.1 R114.2 R125.2
N$73: C90.2 R73.1 R115.2 R124.2
N$74: R68.2 SV2.5
N$75: R69.2 SV2.7
N$82: R97.2 SV3.15
N$91: R70.2 SV2.9
N$92: C4.1 R80.1 R116.2
N$99: R71.2 SV2.11
N$101: R72.2 SV2.13
N$102: R73.2 SV2.15
N$110: C5.1 R81.1 R117.2
N$112: C6.1 R82.1 R118.2
N$126: C7.1 R95.1 R119.2
N$127: IC9.21(B1) R97.1
N$128: R98.2 SV3.13
N$129: R99.2 SV3.11
N$130: R100.2 SV3.9
N$131: R101.2 SV3.7
N$132: R102.2 SV3.5
N$133: R103.2 SV3.3
N$134: R79.2 SV3.1
N$135: IC9.20(B2) R98.1
N$136: IC9.19(B3) R99.1
N$137: IC9.18(B4) R100.1
N$138: IC9.17(B5) R101.1
N$139: IC9.16(B6) R102.1
N$140: IC9.15(B7) R103.1
N$153: C19.1 R96.1 R120.2
N$155: C75.1 R113.1 R121.2
N$157: C89.1 R114.1 R122.2
N$159: C90.1 R115.1 R123.2

### Notes on the sheet
- DIGITAL IO
- Super Scope Pro +2
- Rev: 1
- By: Trond Egil Gran

## Sheet 6 of 13: PSU
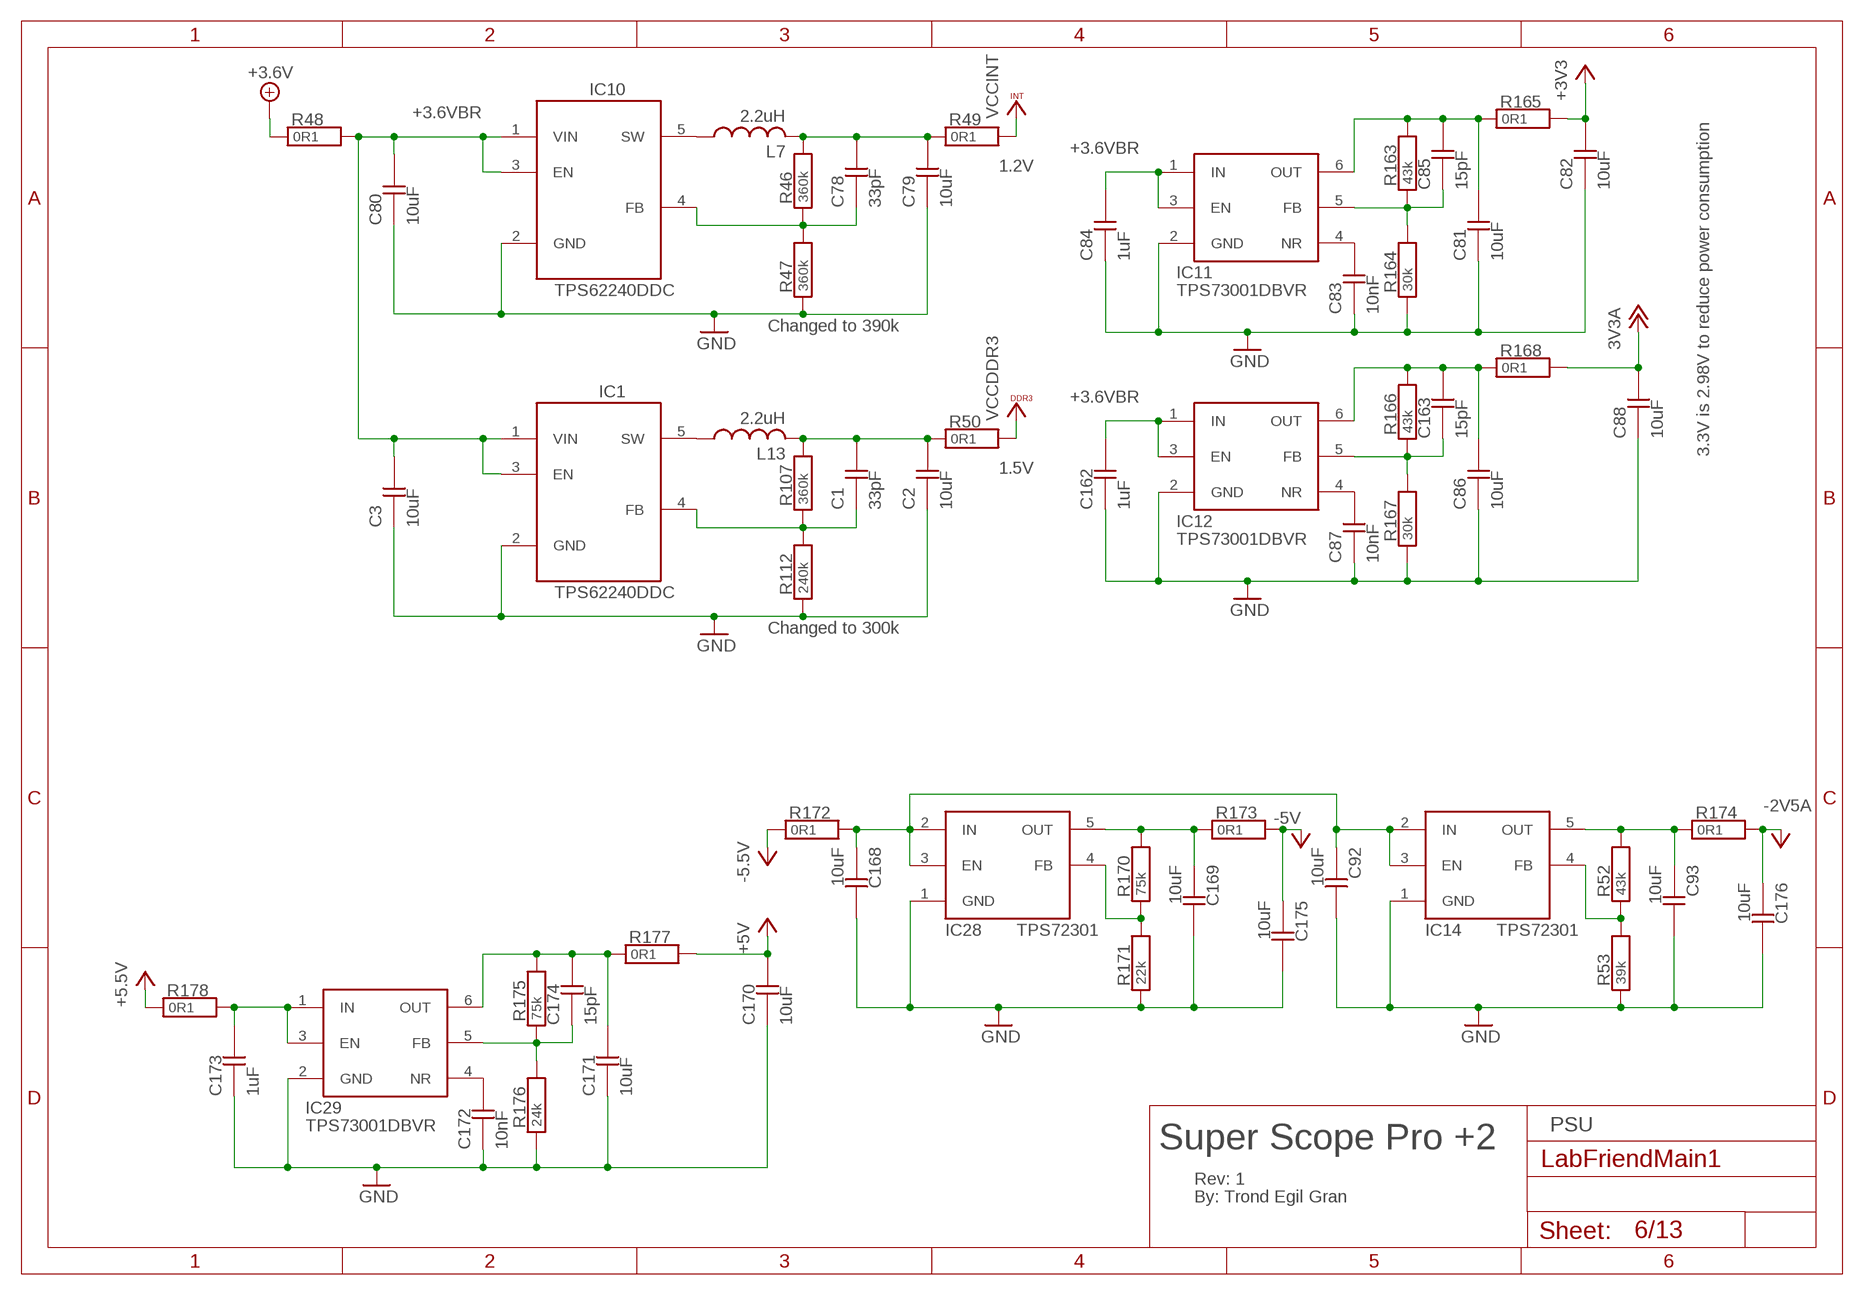
[diagram p5: schematic, sheet 6]

### Parts
C1  33pF  CAPC0603  [0603]
C2  10uF  CAPC0603  [0603]
C3  10uF  CAPC0603  [0603]
C78  33pF  CAPC0603  [0603]
C79  10uF  CAPC0603  [0603]
C80  10uF  CAPC0603  [0603]
C81  10uF  CAPC0603  [0603]
C82  10uF  CAPC0603  [0603]
C83  10nF  CAPC0402  [0402]
C84  1uF  CAPC0603  [0603]
C85  15pF  CAPC0603  [0603]
C86  10uF  CAPC0603  [0603]
C87  10nF  CAPC0402  [0402]
C88  10uF  CAPC0603  [0603]
C92  10uF  CAPC0603  [0603]
C93  10uF  CAPC0603  [0603]
C162  1uF  CAPC0603  [0603]
C163  15pF  CAPC0603  [0603]
C168  10uF  CAPC0603  [0603]
C169  10uF  CAPC0603  [0603]
C170  10uF  CAPC0603  [0603]
C171  10uF  CAPC0603  [0603]
C172  10nF  CAPC0402  [0402]
C173  1uF  CAPC0603  [0603]
C174  15pF  CAPC0603  [0603]
C175  10uF  CAPC0603  [0603]
C176  10uF  CAPC0603  [0603]
IC1  TPS62240DDC  TPS62560  [SOT23-5L]
IC10  TPS62240DDC  TPS62560  [SOT23-5L]
IC11  TPS73001DBVR  TPS73001  [SOT23-6L]
IC12  TPS73001DBVR  TPS73001  [SOT23-6L]
IC14  TPS72301  [SOT23-5L]
IC28  TPS72301  [SOT23-5L]
IC29  TPS73001DBVR  TPS73001  [SOT23-6L]
L7  2.2uH  L-USL3216C  [L3216C]
L13  2.2uH  L-USL3216C  [L3216C]
R46  360k  RESR0603  [0603]
R47  360k  RESR0603  [0603]
R48  0R1  RESR0603  [0603]
R49  0R1  RESR0603  [0603]
R50  0R1  RESR0603  [0603]
R52  43k  RESR0603  [0603]
R53  39k  RESR0603  [0603]
R107  360k  RESR0603  [0603]
R112  240k  RESR0603  [0603]
R163  43k  RESR0603  [0603]
R164  30k  RESR0603  [0603]
R165  0R1  RESR0603  [0603]
R166  43k  RESR0603  [0603]
R167  30k  RESR0603  [0603]
R168  0R1  RESR0603  [0603]
R170  75k  RESR0603  [0603]
R171  22k  RESR0603  [0603]
R172  0R1  RESR0603  [0603]
R173  0R1  RESR0603  [0603]
R174  0R1  RESR0603  [0603]
R175  75k  RESR0603  [0603]
R176  24k  RESR0603  [0603]
R177  0R1  RESR0603  [0603]
R178  0R1  RESR0603  [0603]

### Nets
3V3A: C88.2 R168.2 ; also sheet 3,7,11,12
+3.6V: R48.1 ; also sheet 7,10
+3.6VBR: C3.2 C80.2 C84.2 C162.2 IC1.1(VIN) IC1.3(EN) IC10.1(VIN) IC10.3(EN) IC11.1(IN) IC11.3(EN) IC12.1(IN) IC12.3(EN) R48.2
+3V3: C82.2 R165.2 ; also sheet 1,3,5,8
+5.5V: R178.1 ; also sheet 10
+5.5VI: C173.2 IC29.1(IN) IC29.3(EN) R178.2
+5V: C170.2 R177.2 ; also sheet 7,8,9,11,12,13
-2.5VI: C93.1 IC14.5(OUT) R52.2 R174.1
-2V5A: C176.1 R174.2 ; also sheet 7,11,12
-5.5V: R172.1 ; also sheet 10
-5V: C175.1 R173.2 ; also sheet 7,8,9
GND: C2.1 C3.1 C79.1 C80.1 C81.1 C82.1 C83.1 C84.1 C86.1 C87.1 C88.1 C92.2 C93.2 C162.1 C168.2 C169.2 C170.1 C171.1 C172.1 C173.1 C175.2 C176.2 IC1.2(GND) IC10.2(GND) IC11.2(GND) IC12.2(GND) IC14.1(GND) IC28.1(GND) IC29.2(GND) R47.1 R53.1 R112.1 R164.1 R167.1 R171.1 R176.1 ; also sheet 1,2,3,5,7,8,9,10,11,12,13
N$11: C83.2 IC11.4(NR)
N$65: C78.1 IC10.4(FB) R46.1 R47.2
N$66: IC14.4(FB) R52.1 R53.2
N$67: IC10.5(SW) L7.1
N$80: C92.1 C168.1 IC14.2(IN) IC14.3(EN) IC28.2(IN) IC28.3(EN) R172.2
N$84: C78.2 C79.2 L7.2 R46.2 R49.1
N$85: C87.2 IC12.4(NR)
N$87: C1.2 C2.2 L13.2 R50.1 R107.2
N$150: C1.1 IC1.4(FB) R107.1 R112.2
N$151: IC1.5(SW) L13.1
N$206: C81.2 C85.2 IC11.6(OUT) R163.2 R165.1
N$207: C85.1 IC11.5(FB) R163.1 R164.2
N$208: C86.2 C163.2 IC12.6(OUT) R166.2 R168.1
N$209: C163.1 IC12.5(FB) R166.1 R167.2
N$211: C169.1 IC28.5(OUT) R170.2 R173.1
N$212: IC28.4(FB) R170.1 R171.2
N$214: C172.2 IC29.4(NR)
N$215: C171.2 C174.2 IC29.6(OUT) R175.2 R177.1
N$216: C174.1 IC29.5(FB) R175.1 R176.2
VCCDDR3: R50.2 ; also sheet 2
VCCINT: R49.2 ; also sheet 1

### Notes on the sheet
- 1.2V
- Changed to 390k
- 3.3V is 2.98V to reduce power consumption
- 1.5V
- Changed to 300k
- PSU
- Super Scope Pro +2
- Rev: 1
- By: Trond Egil Gran

## Sheet 7 of 13: References
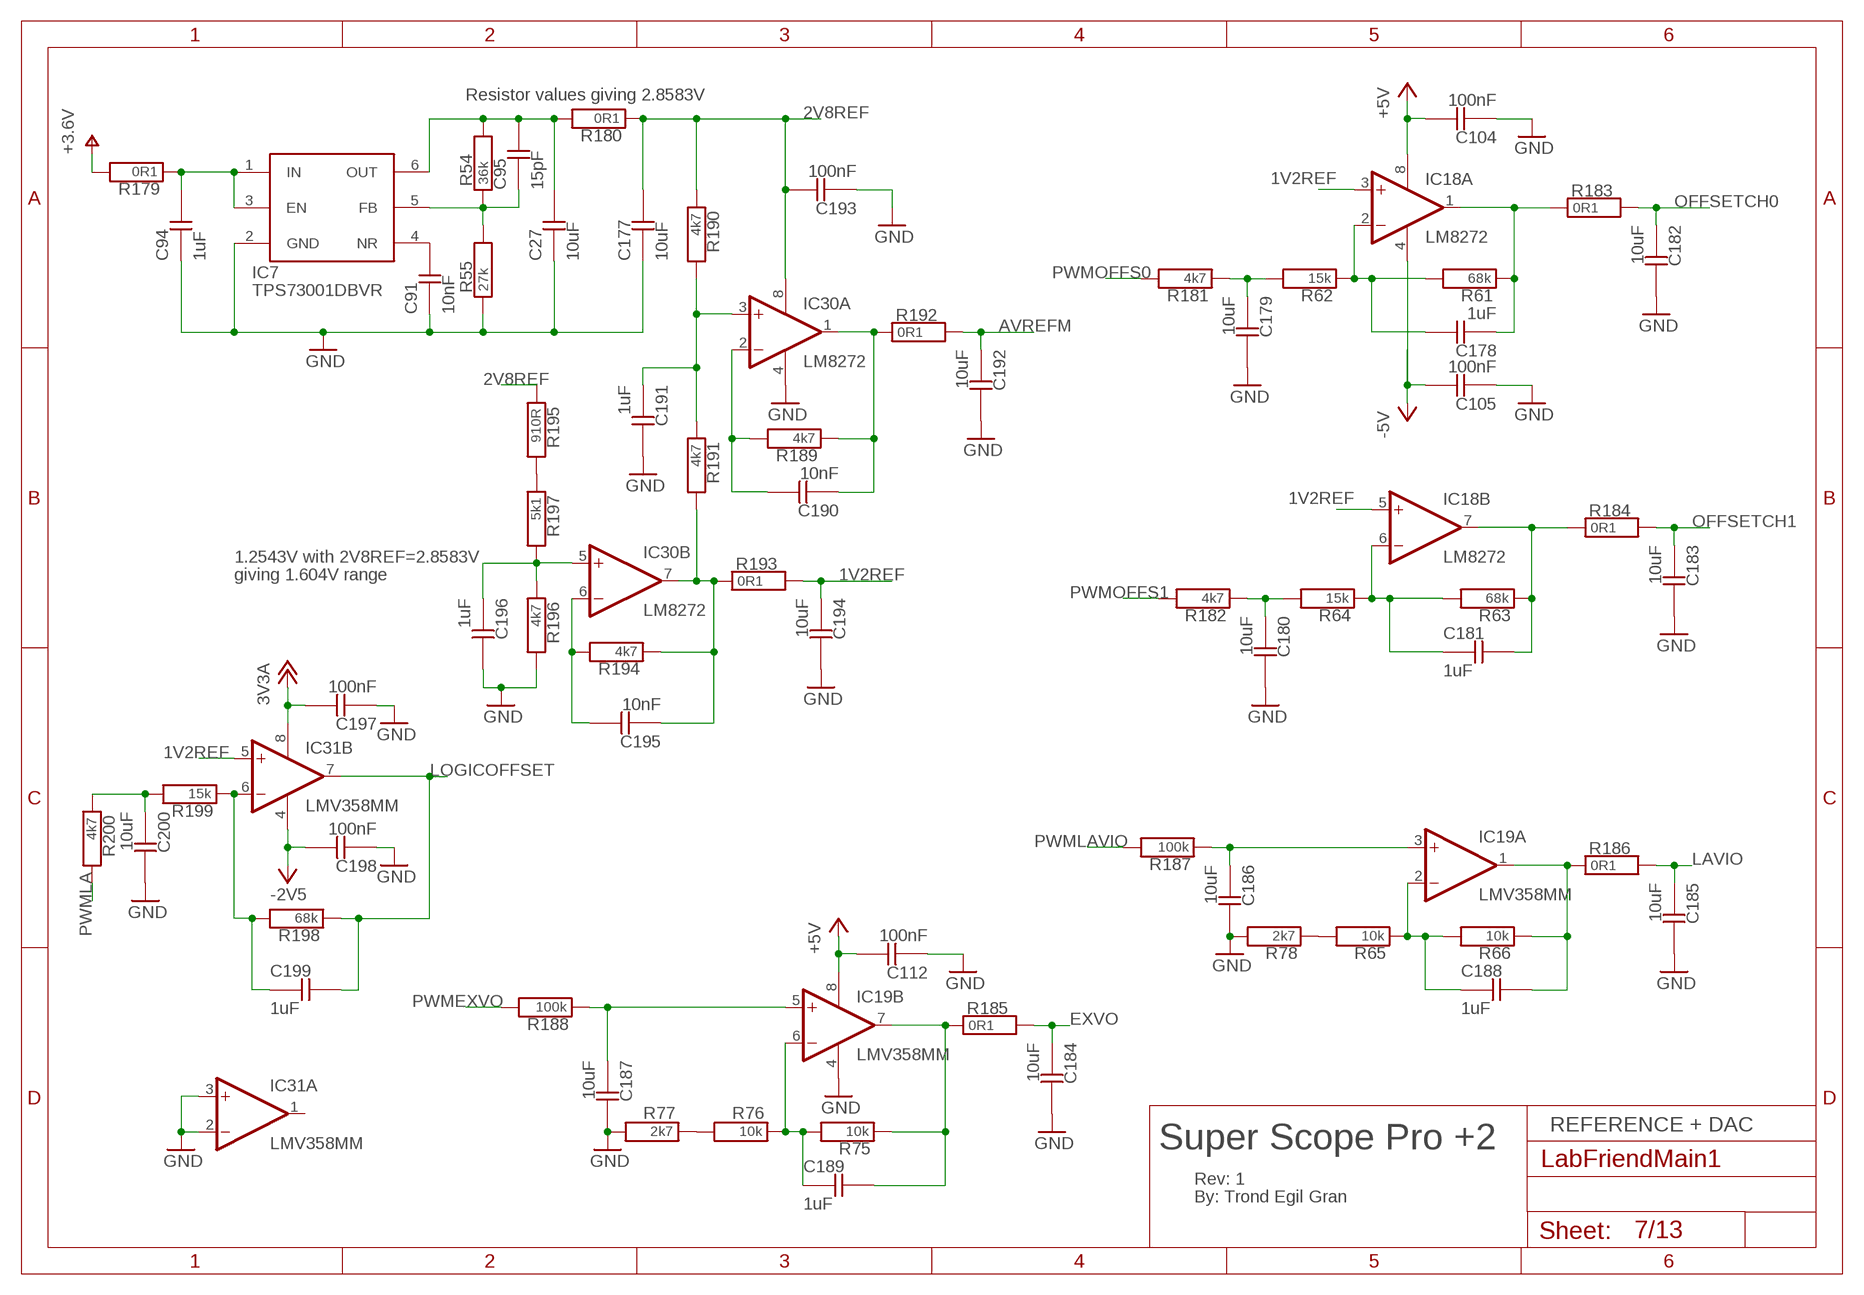
[diagram p6: schematic, sheet 7]

### Parts
C27  10uF  CAPC0603  [0603]
C91  10nF  CAPC0402  [0402]
C94  1uF  CAPC0603  [0603]
C95  15pF  CAPC0603  [0603]
C104  100nF  CAPC0402  [0402]
C105  100nF  CAPC0402  [0402]
C112  100nF  CAPC0402  [0402]
C177  10uF  CAPC0603  [0603]
C178  1uF  CAPC0603  [0603]
C179  10uF  CAPC0603  [0603]
C180  10uF  CAPC0603  [0603]
C181  1uF  CAPC0603  [0603]
C182  10uF  CAPC0603  [0603]
C183  10uF  CAPC0603  [0603]
C184  10uF  CAPC0603  [0603]
C185  10uF  CAPC0603  [0603]
C186  10uF  CAPC0603  [0603]
C187  10uF  CAPC0603  [0603]
C188  1uF  CAPC0603  [0603]
C189  1uF  CAPC0603  [0603]
C190  10nF  CAPC0402  [0402]
C191  1uF  CAPC0603  [0603]
C192  10uF  CAPC0603  [0603]
C193  100nF  CAPC0402  [0402]
C194  10uF  CAPC0603  [0603]
C195  10nF  CAPC0402  [0402]
C196  1uF  CAPC0603  [0603]
C197  100nF  CAPC0402  [0402]
C198  100nF  CAPC0402  [0402]
C199  1uF  CAPC0603  [0603]
C200  10uF  CAPC0603  [0603]
IC7  TPS73001DBVR  TPS73001  [SOT23-6L]
IC18  LM8272  LMV358MM  [MSOP08]
IC19  LMV358MM  [MSOP08]
IC30  LM8272  LMV358MM  [MSOP08]
IC31  LMV358MM  [MSOP08]
R54  36k  RESR0603  [0603]
R55  27k  RESR0603  [0603]
R61  68k  RESR0603  [0603]
R62  15k  RESR0603  [0603]
R63  68k  RESR0603  [0603]
R64  15k  RESR0603  [0603]
R65  10k  RESR0603  [0603]
R66  10k  RESR0603  [0603]
R75  10k  RESR0603  [0603]
R76  10k  RESR0603  [0603]
R77  2k7  RESR0603  [0603]
R78  2k7  RESR0603  [0603]
R179  0R1  RESR0603  [0603]
R180  0R1  RESR0603  [0603]
R181  4k7  RESR0603  [0603]
R182  4k7  RESR0603  [0603]
R183  0R1  RESR0603  [0603]
R184  0R1  RESR0603  [0603]
R185  0R1  RESR0603  [0603]
R186  0R1  RESR0603  [0603]
R187  100k  RESR0603  [0603]
R188  100k  RESR0603  [0603]
R189  4k7  RESR0603  [0603]
R190  4k7  RESR0603  [0603]
R191  4k7  RESR0603  [0603]
R192  0R1  RESR0603  [0603]
R193  0R1  RESR0603  [0603]
R194  4k7  RESR0603  [0603]
R195  910R  RESR0603  [0603]
R196  4k7  RESR0603  [0603]
R197  5k1  RESR0603  [0603]
R198  68k  RESR0603  [0603]
R199  15k  RESR0603  [0603]
R200  4k7  RESR0603  [0603]

### Nets
1V2REF: C194.1 IC18.3(A:+IN) IC18.5(B:+IN) IC31.5(B:+IN) R193.2 ; also sheet 3
2V8REF: C177.2 C193.2 IC30.8(P:V+) R180.1 R190.1 R195.1 ; also sheet 3
3V3A: C197.2 IC31.8(P:V+) ; also sheet 3,6,11,12
+3.6V: R179.2 ; also sheet 6,10
+3.6VI: C94.2 IC7.1(IN) IC7.3(EN) R179.1
+5V: C104.2 C112.2 IC18.8(P:V+) IC19.8(P:V+) ; also sheet 6,8,9,11,12,13
-2V5A: C198.2 IC31.4(P:V-) ; supply symbol labelled -2V5 ; also sheet 6,11,12
-5V: C105.2 IC18.4(P:V-) ; also sheet 6,8,9
AVREFM: C192.1 R192.2 ; also sheet 9,11,12
EXVO: C184.1 R185.2 ; also sheet 9
EXVOI: C189.2 IC19.7(B:OUT) R75.1 R185.1
GND: C27.1 C91.1 C94.1 C104.1 C105.1 C112.1 C177.1 C179.2 C180.2 C182.2 C183.2 C184.2 C185.2 C186.2 C187.2 C191.2 C192.2 C193.1 C194.2 C196.2 C197.1 C198.1 C200.2 IC7.2(GND) IC19.4(P:V-) IC30.4(P:V-) IC31.2(A:-IN) IC31.3(A:+IN) R55.1 R77.2 R78.2 R196.2 ; also sheet 1,2,3,5,6,8,9,10,11,12,13
LAVIO: C185.1 R186.2 ; also sheet 5
LAVIOI: C188.2 IC19.1(A:OUT) R66.1 R186.1
LOGICOFFSET: C199.2 IC31.7(B:OUT) R198.1 ; also sheet 5
N$23: C191.1 IC30.3(A:+IN) R190.2 R191.1
N$81: C91.2 IC7.4(NR)
N$86: C188.1 IC19.2(A:-IN) R65.1 R66.2
N$93: C178.2 IC18.2(A:-IN) R61.2 R62.1
N$94: C27.2 C95.2 IC7.6(OUT) R54.2 R180.2
N$95: C181.1 IC18.6(B:-IN) R63.2 R64.1
N$96: C179.1 R62.2 R181.1
N$97: C180.1 R64.2 R182.1
N$98: C186.1 IC19.3(A:+IN) R187.1
N$100: C187.1 IC19.5(B:+IN) R188.1
N$105: R76.2 R77.1
N$106: C95.1 IC7.5(FB) R54.1 R55.2
N$107: C189.1 IC19.6(B:-IN) R75.2 R76.1
N$108: R65.2 R78.1
N$204: R195.2 R197.1
N$213: C190.1 IC30.1(A:OUT) R189.1 R192.1
N$217: C190.2 IC30.2(A:-IN) R189.2
N$218: C195.1 IC30.7(B:OUT) R191.2 R193.1 R194.1
N$219: C195.2 IC30.6(B:-IN) R194.2
N$220: C196.1 IC30.5(B:+IN) R196.1 R197.2
N$221: C199.1 IC31.6(B:-IN) R198.2 R199.1
N$223: C200.1 R199.2 R200.1
OFFSETCH0: C182.1 R183.2 ; also sheet 12
OFFSETCH0I: C178.1 IC18.1(A:OUT) R61.1 R183.1
OFFSETCH1: C183.1 R184.2 ; also sheet 11
OFFSETCH1I: C181.2 IC18.7(B:OUT) R63.1 R184.1
PWMEXVO: R188.2 ; also sheet 1
PWMLA: R200.2 ; also sheet 3
PWMLAVIO: R187.2 ; also sheet 1
PWMOFFS0: R181.2 ; also sheet 1
PWMOFFS1: R182.2 ; also sheet 1
Unconnected: IC31.1(A:OUT)

### Notes on the sheet
- Resistor values giving 2.8583V
- 1.2543V with 2V8REF=2.8583V
- giving 1.604V range
- REFERENCE + DAC
- Super Scope Pro +2
- Rev: 1
- By: Trond Egil Gran

## Sheet 8 of 13: Audio IO
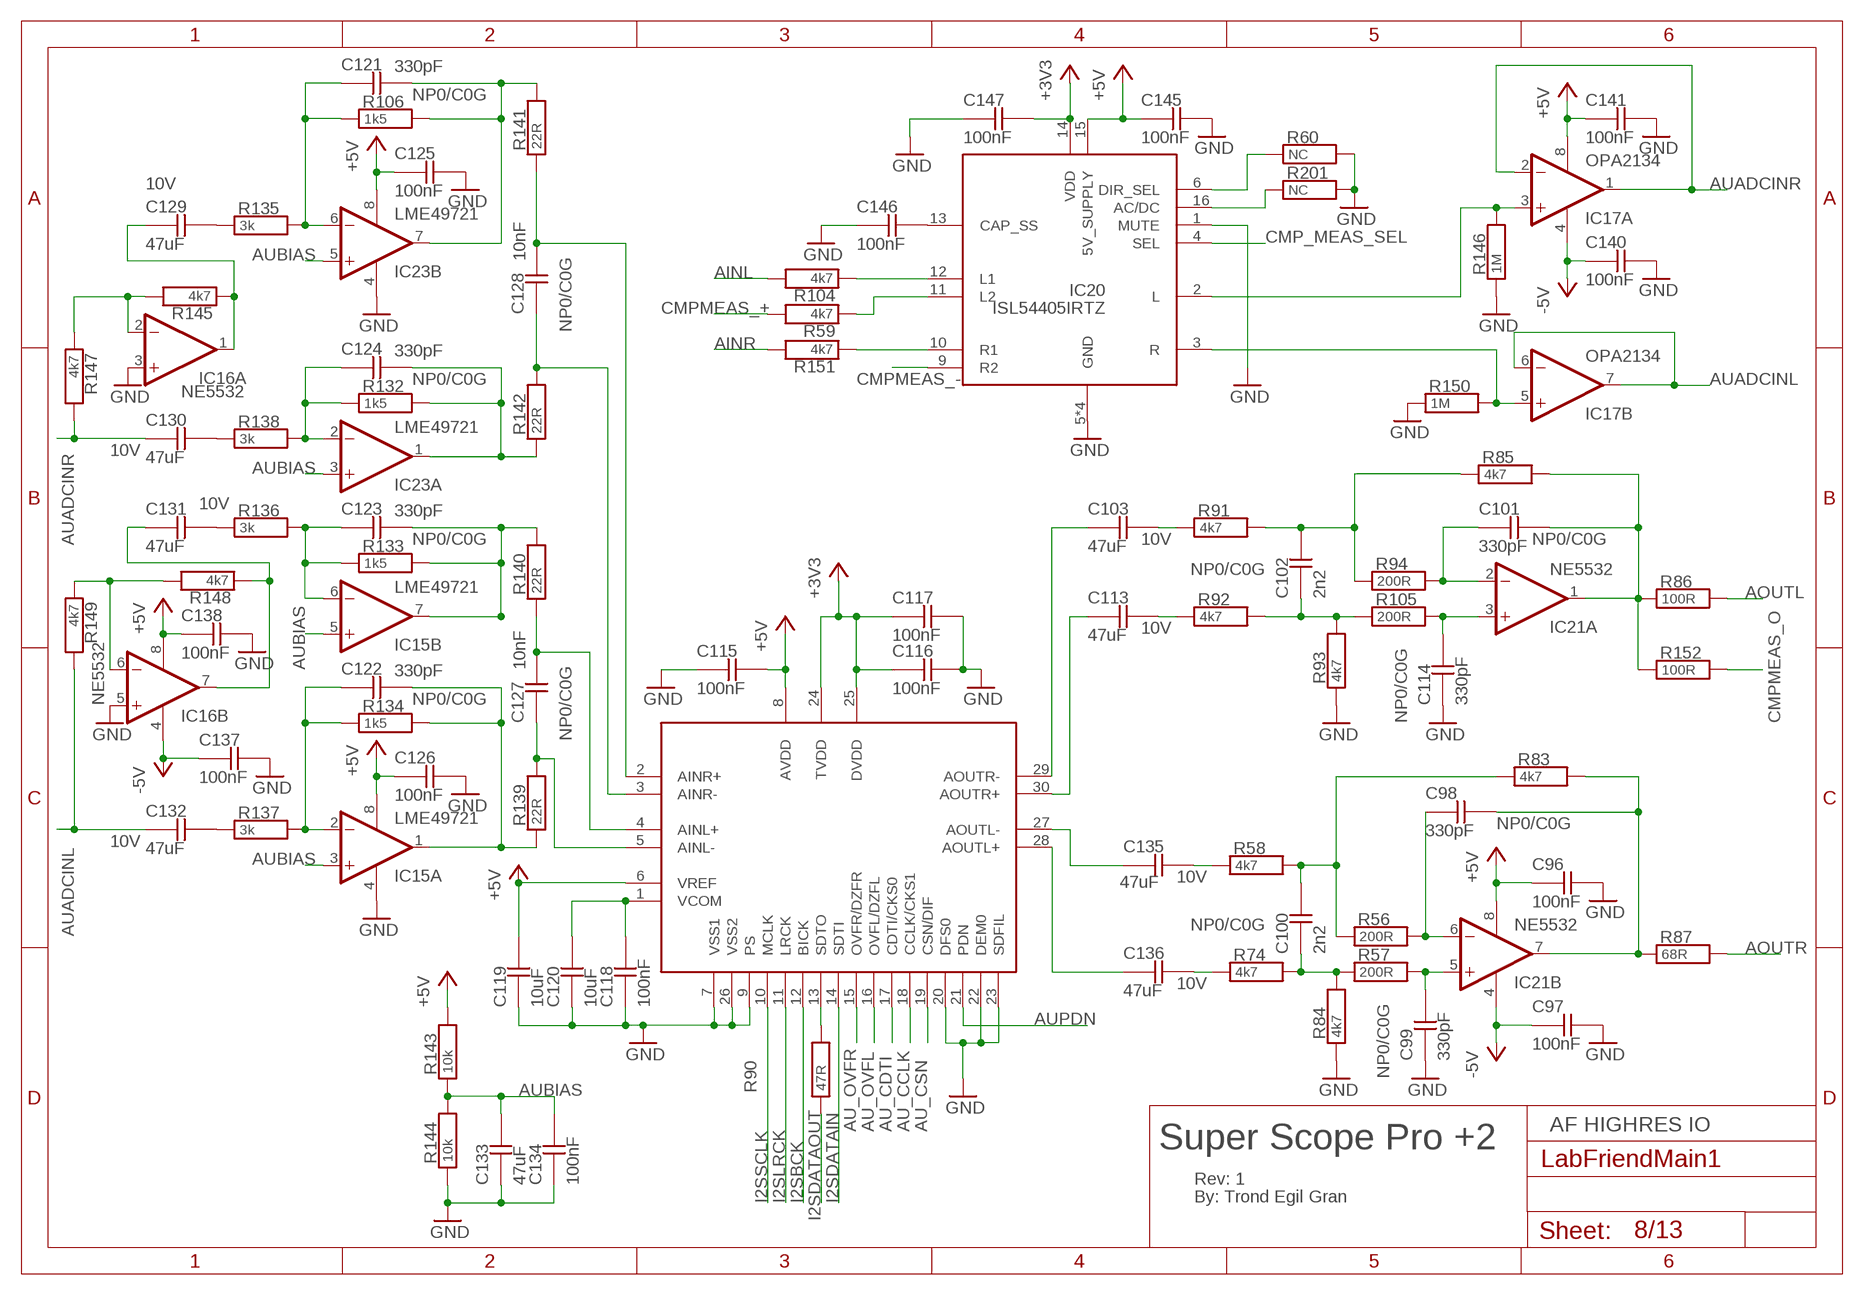
[diagram p7: schematic, sheet 8]

### Parts
C96  100nF  CAPC0402  [0402]
C97  100nF  CAPC0402  [0402]
C98  330pF  CAPC0603  [0603]
C99  330pF  CAPC0603  [0603]
C100  2n2  CAPC0603  [0603]
C101  330pF  CAPC0603  [0603]
C102  2n2  CAPC0603  [0603]
C103  47uF  CAPC1206  [1206]
C113  47uF  CAPC1206  [1206]
C114  330pF  CAPC0603  [0603]
C115  100nF  CAPC0402  [0402]
C116  100nF  CAPC0402  [0402]
C117  100nF  CAPC0402  [0402]
C118  100nF  CAPC0402  [0402]
C119  10uF  CAPC0603  [0603]
C120  10uF  CAPC0603  [0603]
C121  330pF  CAPC0603  [0603]
C122  330pF  CAPC0603  [0603]
C123  330pF  CAPC0603  [0603]
C124  330pF  CAPC0603  [0603]
C125  100nF  CAPC0402  [0402]
C126  100nF  CAPC0402  [0402]
C127  10nF  CAPC0603  [0603]
C128  10nF  CAPC0603  [0603]
C129  47uF  CAPC1206  [1206]
C130  47uF  CAPC1206  [1206]
C131  47uF  CAPC1206  [1206]
C132  47uF  CAPC1206  [1206]
C133  47uF  CAPC1206  [1206]
C134  100nF  CAPC0402  [0402]
C135  47uF  CAPC1206  [1206]
C136  47uF  CAPC1206  [1206]
C137  100nF  CAPC0402  [0402]
C138  100nF  CAPC0402  [0402]
C140  100nF  CAPC0402  [0402]
C141  100nF  CAPC0402  [0402]
C145  100nF  CAPC0402  [0402]
C146  100nF  CAPC0402  [0402]
C147  100nF  CAPC0402  [0402]
IC13  AK4621  [VSOP30]
IC15  LME49721  LM358D  [SO08]
IC16  NE5532  LM358D  [SO08]
IC17  OPA2134  LM358D  [SO08]
IC20  ISL54405IRTZ  [TQFN3X3]
IC21  NE5532  LM358D  [SO08]
IC23  LME49721  LM358D  [SO08]
R56  200R  RESR0603  [0603]
R57  200R  RESR0603  [0603]
R58  4k7  RESR0603  [0603]
R59  4k7  RESR0603  [0603]
R60  NC  RESR0402  [0402]
R74  4k7  RESR0603  [0603]
R83  4k7  RESR0603  [0603]
R84  4k7  RESR0603  [0603]
R85  4k7  RESR0603  [0603]
R86  100R  RESR0402  [0402]
R87  68R  RESR0603  [0603]
R90  47R  RESR0402  [0402]
R91  4k7  RESR0603  [0603]
R92  4k7  RESR0603  [0603]
R93  4k7  RESR0603  [0603]
R94  200R  RESR0603  [0603]
R104  4k7  RESR0603  [0603]
R105  200R  RESR0603  [0603]
R106  1k5  RESR0603  [0603]
R132  1k5  RESR0603  [0603]
R133  1k5  RESR0603  [0603]
R134  1k5  RESR0603  [0603]
R135  3k  RESR0603  [0603]
R136  3k  RESR0603  [0603]
R137  3k  RESR0603  [0603]
R138  3k  RESR0603  [0603]
R139  22R  RESR0603  [0603]
R140  22R  RESR0603  [0603]
R141  22R  RESR0603  [0603]
R142  22R  RESR0603  [0603]
R143  10k  RESR0603  [0603]
R144  10k  RESR0603  [0603]
R145  4k7  RESR0603  [0603]
R146  1M  RESR0603  [0603]
R147  4k7  RESR0603  [0603]
R148  4k7  RESR0603  [0603]
R149  4k7  RESR0603  [0603]
R150  1M  RESR0603  [0603]
R151  4k7  RESR0603  [0603]
R152  100R  RESR0402  [0402]
R201  NC  RESR0402  [0402]

### Nets
+3V3: C116.1 C117.1 C147.2 IC13.24(TVDD) IC13.25(DVDD) IC20.14(VDD) ; also sheet 1,3,5,6
+5V: C96.1 C115.2 C119.2 C125.1 C126.1 C138.1 C141.1 C145.1 IC13.6(VREF) IC13.8(AVDD) IC15.8(P:V+) IC16.8(P:V+) IC17.8(P:V+) IC20.15(5V_SUPPLY) IC21.8(P:V+) IC23.8(P:V+) R143.2 ; also sheet 6,7,9,11,12,13
-5V: C97.1 C137.1 C140.1 IC16.4(P:V-) IC17.4(P:V-) IC21.4(P:V-) ; also sheet 6,7,9
AINL: R104.2 ; also sheet 9
AINR: R151.2 ; also sheet 9
AOUTL: R86.2 ; also sheet 9
AOUTR: R87.2 ; also sheet 9
AU_CCLK: IC13.18(CCLK/CKS1) ; also sheet 3,9
AU_CDTI: IC13.17(CDTI/CKS0) ; also sheet 3,9
AU_CSN: IC13.19(CSN/DIF) ; also sheet 3
AU_OVFL: IC13.16(OVFL/DZFL) ; also sheet 3
AU_OVFR: IC13.15(OVFR/DZFR) ; also sheet 3
AUADCINL: C132.1 IC17.6(B:-IN) IC17.7(B:OUT) R149.2
AUADCINR: C130.1 IC17.1(A:OUT) IC17.2(A:-IN) R147.2
AUBIAS: C133.2 C134.2 IC15.3(A:+IN) IC15.5(B:+IN) IC23.3(A:+IN) IC23.5(B:+IN) R143.1 R144.2
AUPDN: IC13.21(PDN) ; also sheet 3
CMP_MEAS_SEL: IC20.4(SEL) ; also sheet 3
CMPMEAS_+: R59.2 ; also sheet 9
CMPMEAS_-: IC20.9(R2) ; also sheet 9
CMPMEAS_O: R152.2 ; also sheet 9
GND: C96.2 C97.2 C99.1 C114.1 C115.1 C116.2 C117.2 C118.1 C119.1 C120.1 C125.2 C126.2 C133.1 C134.1 C137.2 C138.2 C140.2 C141.2 C145.2 C146.1 C147.1 IC13.7(VSS1) IC13.9(PS) IC13.20(DFS0) IC13.22(DEM0) IC13.23(SDFIL) IC13.26(VSS2) IC15.4(P:V-) IC16.3(A:+IN) IC16.5(B:+IN) IC20.1(MUTE) IC20.5(GND) IC20.7(GND) IC20.8(GND) IC20.GPD(GND) IC23.4(P:V-) R60.2 R84.1 R93.1 R144.1 R146.1 R150.1 R201.2 ; also sheet 1,2,3,5,6,7,9,10,11,12,13
I2SBCK: IC13.12(BICK) ; also sheet 3
I2SDATAIN: IC13.14(SDTI) ; also sheet 3
I2SDATAOUT: R90.1 ; also sheet 3
I2SLRCK: IC13.11(LRCK) ; also sheet 3
I2SSCLK: IC13.10(MCLK) ; also sheet 3
N$14: C98.1 IC21.6(B:-IN) R56.2
N$76: C99.2 IC21.5(B:+IN) R57.2
N$77: C98.2 IC21.7(B:OUT) R83.2 R87.1
N$78: C100.2 R56.1 R58.2 R83.1
N$79: C100.1 R57.1 R74.2 R84.2
N$83: C135.2 R58.1
N$88: C136.2 R74.1
N$109: C101.2 IC21.1(A:OUT) R85.2 R86.1 R152.1
N$111: C101.1 IC21.2(A:-IN) R94.2
N$113: C114.2 IC21.3(A:+IN) R105.2
N$114: C102.2 R85.1 R91.2 R94.1
N$115: C121.2 IC23.7(B:OUT) R106.2 R141.2
N$116: C102.1 R92.2 R93.2 R105.1
N$118: C103.2 R91.1
N$119: C113.2 R92.1
N$120: C103.1 IC13.29(AOUTR-)
N$121: IC13.13(SDTO) R90.2
N$122: C113.1 IC13.30(AOUTR+)
N$123: C136.1 IC13.28(AOUTL+)
N$124: C135.1 IC13.27(AOUTL-)
N$125: C121.1 IC23.6(B:-IN) R106.1 R135.2
N$141: C124.2 IC23.1(A:OUT) R132.2 R142.1
N$143: C123.2 IC15.7(B:OUT) R133.2 R140.2
N$145: C118.2 C120.2 IC13.1(VCOM)
N$146: C122.2 IC15.1(A:OUT) R134.2 R139.1
N$147: IC20.12(L1) R104.1
N$152: C122.1 IC15.2(A:-IN) R134.1 R137.2
N$154: C123.1 IC15.6(B:-IN) R133.1 R136.2
N$156: C124.1 IC23.2(A:-IN) R132.1 R138.2
N$158: C127.2 IC13.4(AINL+) R140.1
N$160: C127.1 IC13.5(AINL-) R139.2
N$161: C128.1 IC13.3(AINR-) R142.2
N$166: C128.2 IC13.2(AINR+) R141.1
N$167: C129.2 R135.1
N$168: C130.2 R138.1
N$169: C131.2 R136.1
N$170: C132.2 R137.1
N$171: C131.1 IC16.7(B:OUT) R148.1
N$172: IC17.5(B:+IN) IC20.3(R) R150.2
N$173: IC17.3(A:+IN) IC20.2(L) R146.2
N$174: C146.2 IC20.13(CAP_SS)
N$175: C129.1 IC16.1(A:OUT) R145.1
N$176: IC16.2(A:-IN) R145.2 R147.1
N$177: IC16.6(B:-IN) R148.2 R149.1
N$178: IC20.10(R1) R151.1
N$183: IC20.11(L2) R59.1
N$222: IC20.16(AC/DC) R201.1
N$224: IC20.6(DIR_SEL) R60.1

### Notes on the sheet
- AF HIGHRES IO
- Super Scope Pro +2
- Rev: 1
- By: Trond Egil Gran

## Sheet 9 of 13: Precision AD, Diff Scope Input, Component Value Meas
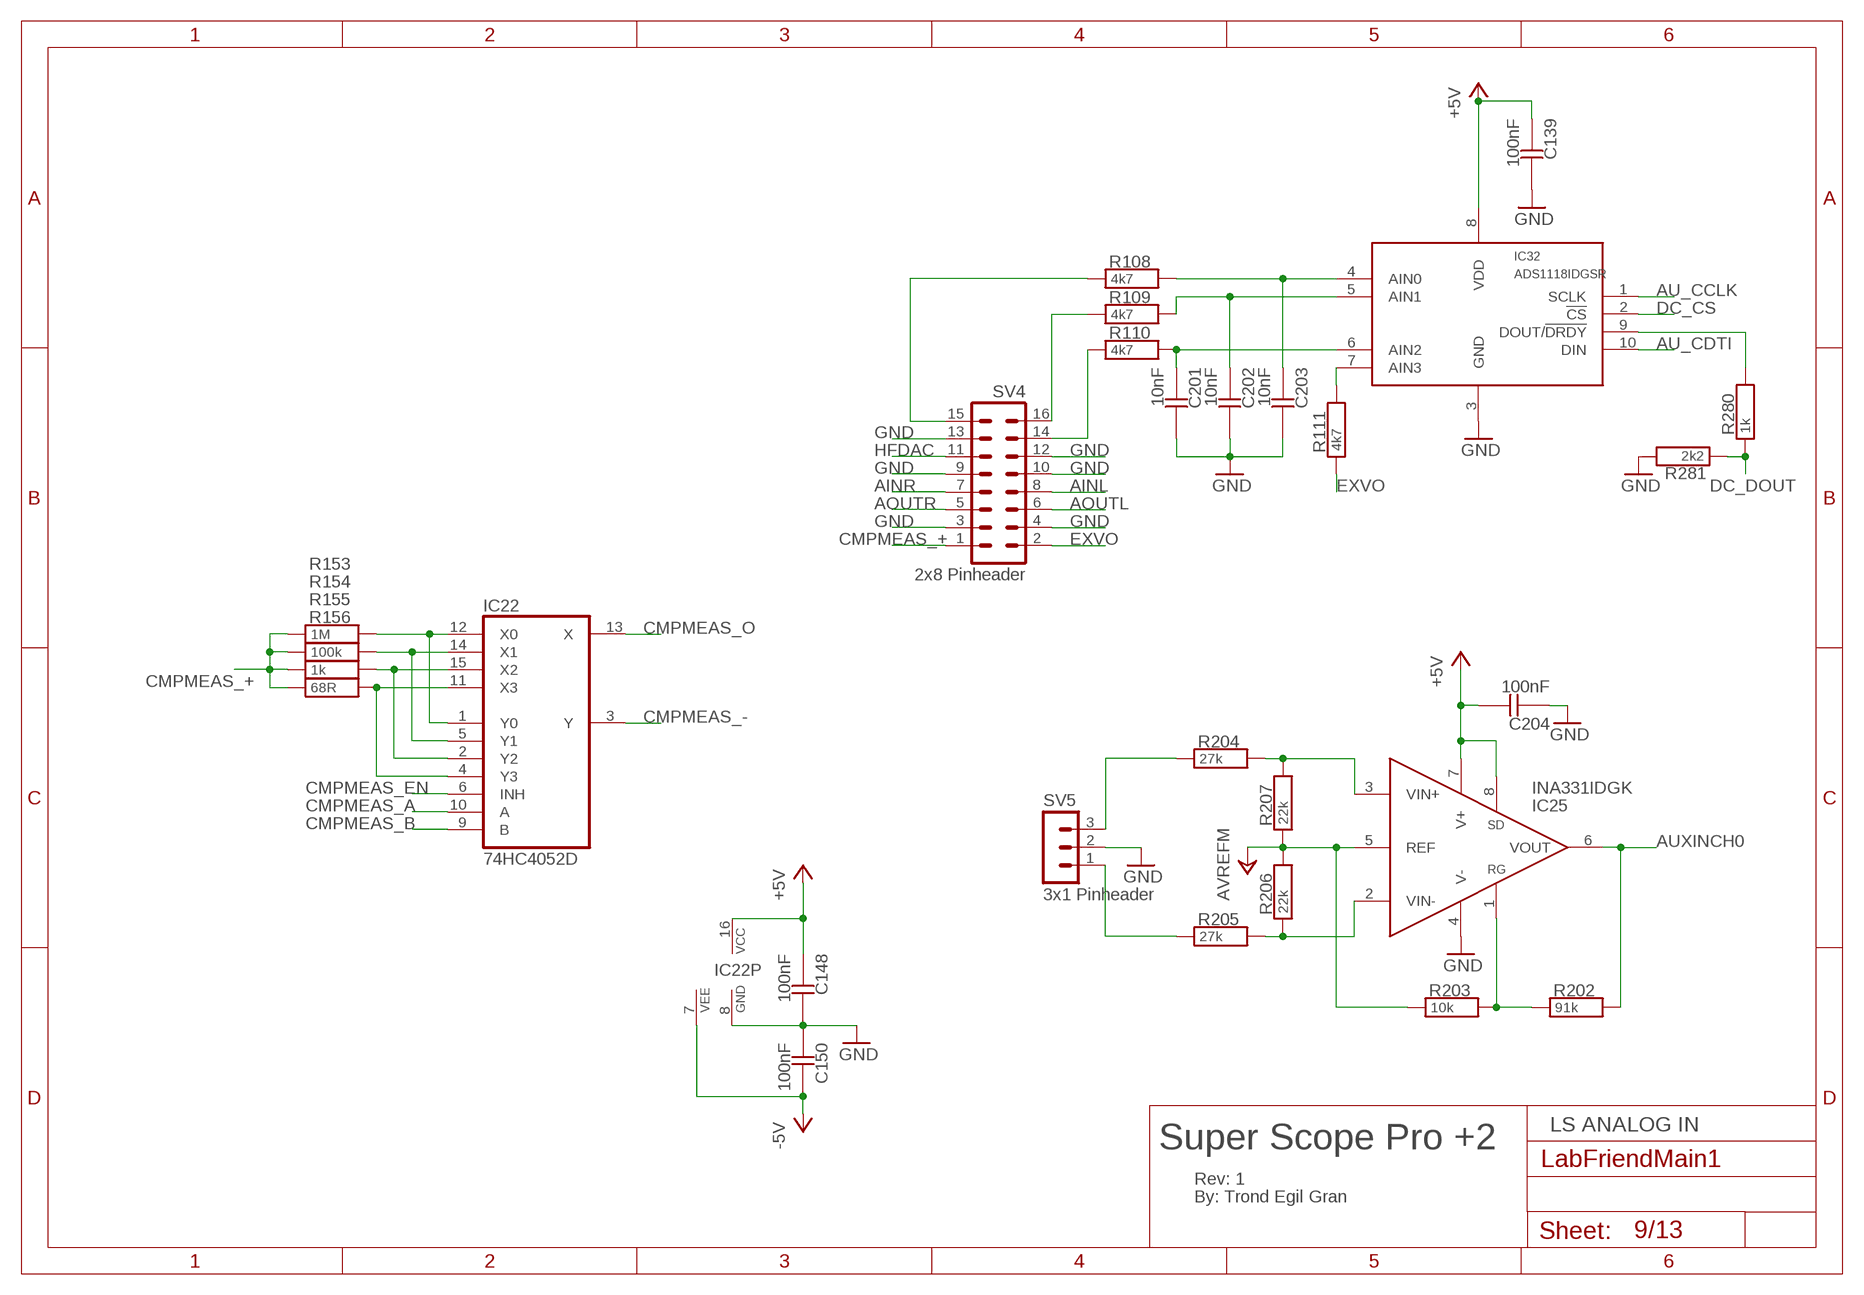
[diagram p8: schematic, sheet 9]

### Parts
C139  100nF  CAPC0402  [0402]
C148  100nF  CAPC0402  [0402]
C150  100nF  CAPC0402  [0402]
C201  10nF  CAPC0402  [0402]
C202  10nF  CAPC0402  [0402]
C203  10nF  CAPC0402  [0402]
C204  100nF  CAPC0402  [0402]
IC22  74HC4052D  4052D  [SO16]
IC25  INA331IDGK  [MSOP08]
IC32  ADS1118IDGSR  [MSOP10]
R108  4k7  RESR0402  [0402]
R109  4k7  RESR0402  [0402]
R110  4k7  RESR0402  [0402]
R111  4k7  RESR0402  [0402]
R153  1M  RESR0603  [0603]
R154  100k  RESR0603  [0603]
R155  1k  RESR0603  [0603]
R156  68R  RESR0603  [0603]
R202  91k  RESR0603  [0603]
R203  10k  RESR0603  [0603]
R204  27k  RESR0603  [0603]
R205  27k  RESR0603  [0603]
R206  22k  RESR0603  [0603]
R207  22k  RESR0603  [0603]
R280  1k  RESR0402  [0402]
R281  2k2  RESR0402  [0402]
SV4  2x8 Pinheader  MA08-2W  [MA08-2W]
SV5  3x1 Pinheader  MA03-1  [MA03-1]

### Nets
+5V: C139.1 C148.1 C204.2 IC22.16(VCC) IC25.7(V+) IC25.8(SD) IC32.8(VDD) ; also sheet 6,7,8,11,12,13
-5V: C150.2 IC22.7(VEE) ; also sheet 6,7,8
AINL: SV4.8 ; also sheet 8
AINR: SV4.7 ; also sheet 8
AOUTL: SV4.6 ; also sheet 8
AOUTR: SV4.5 ; also sheet 8
AU_CCLK: IC32.1(SCLK) ; also sheet 3,8
AU_CDTI: IC32.10(DIN) ; also sheet 3,8
AUXINCH0: IC25.6(VOUT) R202.2 ; also sheet 12
AVREFM: IC25.5(REF) R203.1 R206.2 R207.1 ; also sheet 7,11,12
CMPMEAS_+: R153.1 R154.1 R155.1 R156.1 SV4.1 ; also sheet 8
CMPMEAS_-: IC22.3(Y) ; also sheet 8
CMPMEAS_A: IC22.10(A) ; also sheet 3
CMPMEAS_B: IC22.9(B) ; also sheet 3
CMPMEAS_EN: IC22.6(INH) ; also sheet 1
CMPMEAS_O: IC22.13(X) ; also sheet 8
DC_CS: IC32.2(!CS) ; also sheet 3
DC_DOUT: R280.1 R281.1 ; also sheet 3
EXVO: R111.1 SV4.2 ; also sheet 7
GND: C139.2 C148.2 C150.1 C201.2 C202.2 C203.2 C204.1 IC22.8(GND) IC25.4(V-) IC32.3(GND) R281.2 SV4.3 SV4.4 SV4.9 SV4.10 SV4.12 SV4.13 SV5.2 ; also sheet 1,2,3,5,6,7,8,10,11,12,13
HFDAC: SV4.11 ; also sheet 13
N$117: C203.1 IC32.4(AIN0) R108.2
N$142: C202.1 IC32.5(AIN1) R109.2
N$144: C201.1 IC32.6(AIN2) R110.2
N$162: R108.1 SV4.15
N$163: R109.1 SV4.16
N$164: IC32.7(AIN3) R111.2
N$165: R110.1 SV4.14
N$179: IC22.1(Y0) IC22.12(X0) R153.2
N$180: IC22.5(Y1) IC22.14(X1) R154.2
N$181: IC22.2(Y2) IC22.15(X2) R155.2
N$182: IC22.4(Y3) IC22.11(X3) R156.2
N$225: IC25.1(RG) R202.1 R203.2
N$226: IC25.3(VIN+) R204.2 R207.2
N$227: IC25.2(VIN-) R205.2 R206.1
N$228: R204.1 SV5.3
N$229: R205.1 SV5.1
N$332: IC32.9(DOUT/!DRDY) R280.2

### Notes on the sheet
- LS ANALOG IN
- Super Scope Pro +2
- Rev: 1
- By: Trond Egil Gran

## Sheet 10 of 13: Isolated DCDC
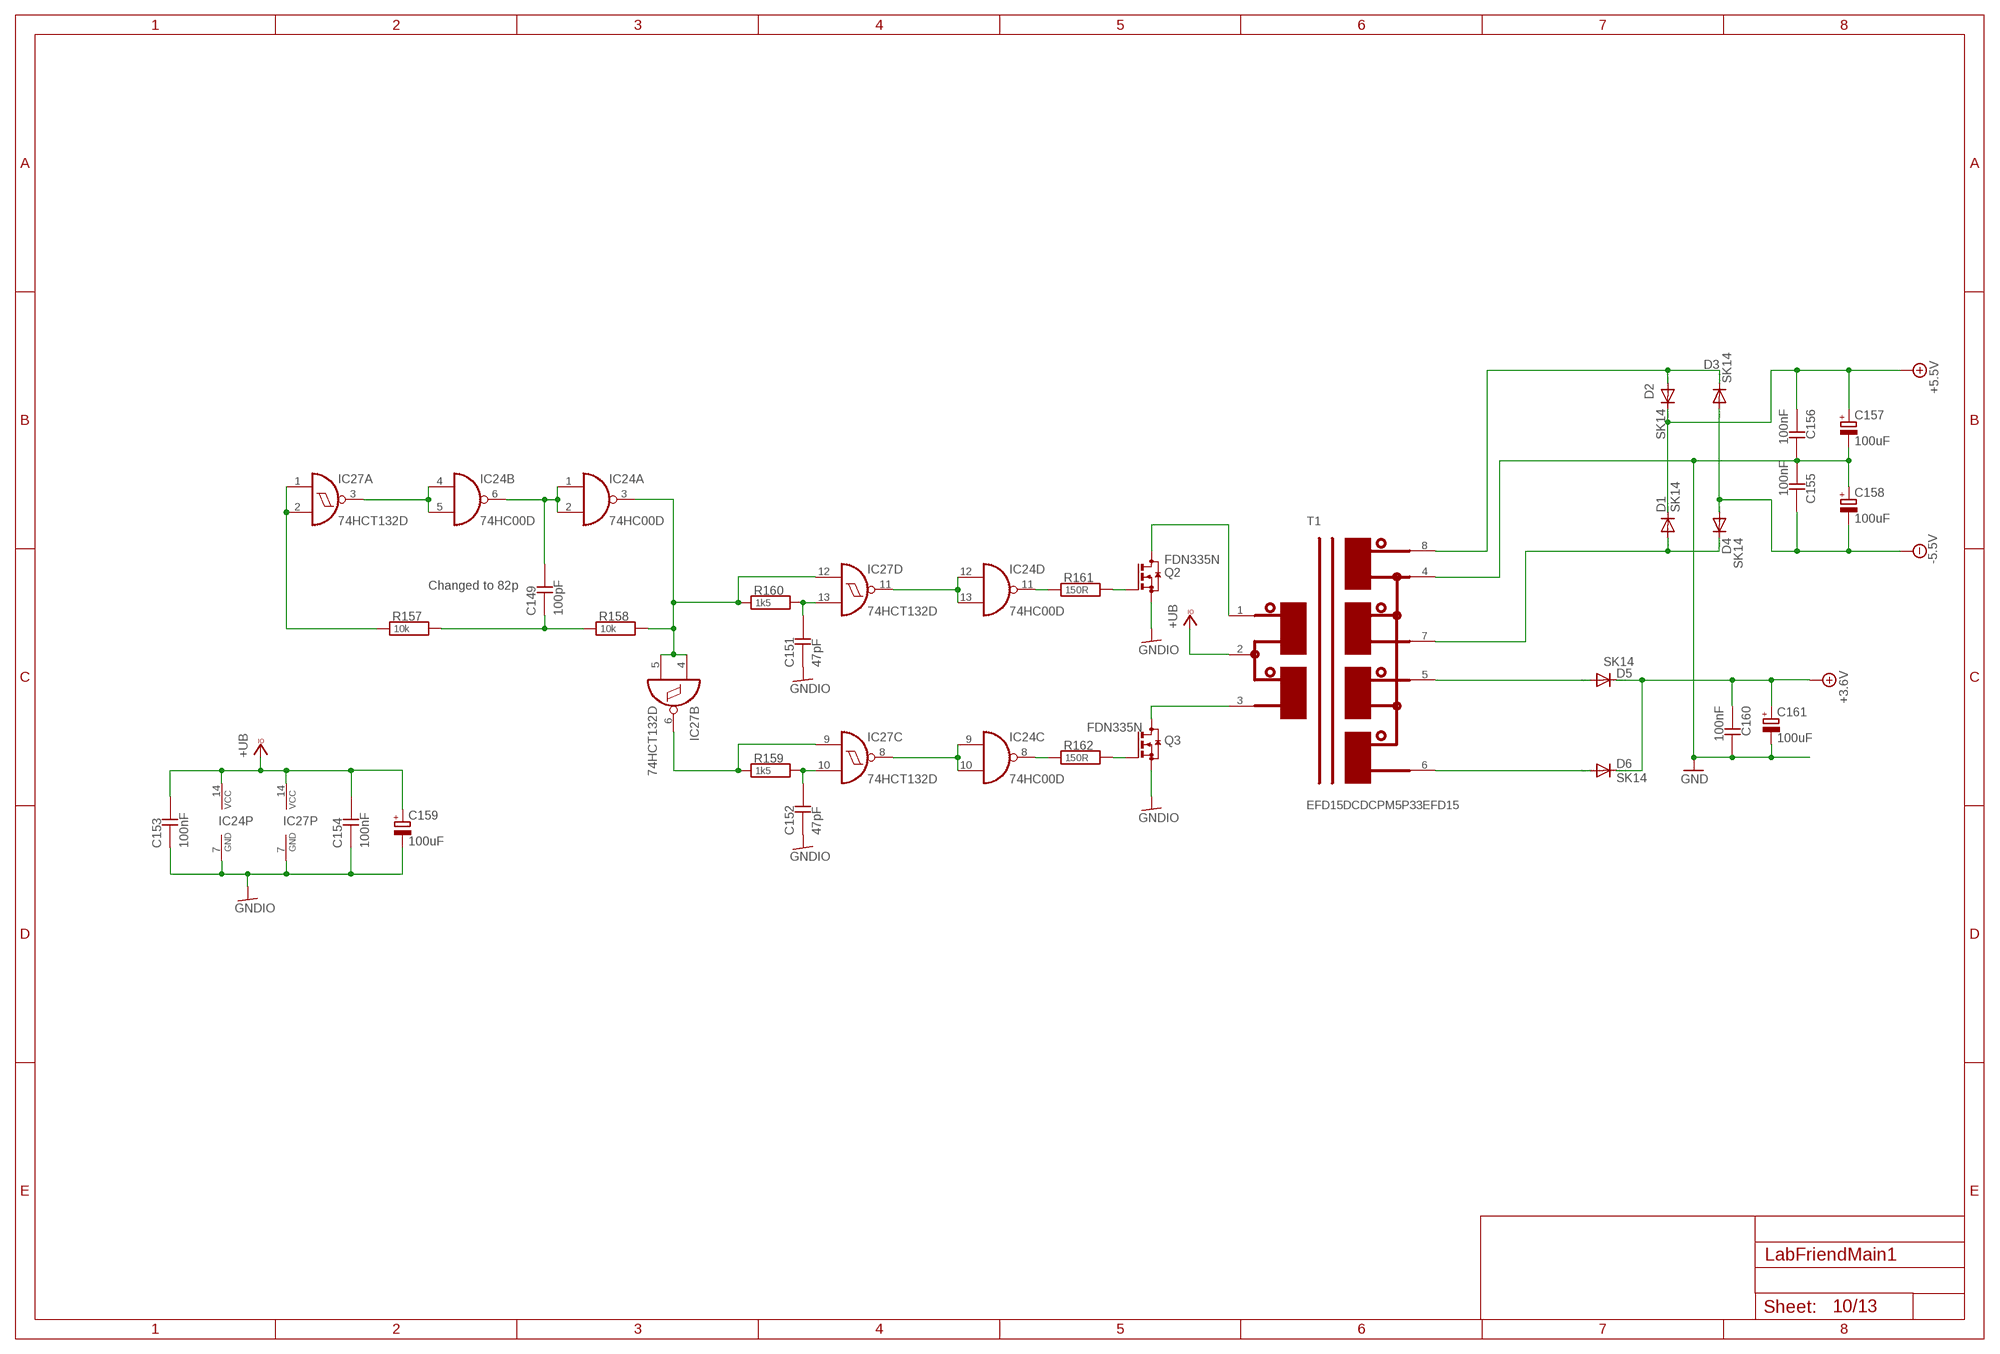
[diagram p9: schematic, sheet 10]

### Parts
C149  100pF  CAPC0603  [0603]
C151  47pF  CAPC0603  [0603]
C152  47pF  CAPC0603  [0603]
C153  100nF  CAPC0402  [0402]
C154  100nF  CAPC0402  [0402]
C155  100nF  CAPC0402  [0402]
C156  100nF  CAPC0402  [0402]
C157  100uF  CPOL-EUCT6032  [CT6032]
C158  100uF  CPOL-EUCT6032  [CT6032]
C159  100uF  CPOL-EUCT6032  [CT6032]
C160  100nF  CAPC0402  [0402]
C161  100uF  CPOL-EUCT6032  [CT6032]
D1  SK14  DIODE-DO214AC  [DO214AC]
D2  SK14  DIODE-DO214AC  [DO214AC]
D3  SK14  DIODE-DO214AC  [DO214AC]
D4  SK14  DIODE-DO214AC  [DO214AC]
D5  SK14  DIODE-DO214AC  [DO214AC]
D6  SK14  DIODE-DO214AC  [DO214AC]
IC24  74HC00D  [SO14]
IC27  74HCT132D  [SO14]
Q2  FDN335N  BSS123  [SOT23]
Q3  FDN335N  BSS123  [SOT23]
R157  10k  RESR0603  [0603]
R158  10k  RESR0603  [0603]
R159  1k5  RESR0603  [0603]
R160  1k5  RESR0603  [0603]
R161  150R  RESR0603  [0603]
R162  150R  RESR0603  [0603]
T1  EFD15DCDCPM5P33EFD15  [B66414-W1008-D1]

### Nets
+3.6V: C160.1 C161.+ D5.C D6.C ; also sheet 6,7
+5.5V: C156.1 C157.+ D1.C D2.C ; also sheet 6
+UB: C153.2 C154.2 C159.+ IC24.14(P:VCC) IC27.14(P:VCC) T1.2(P1M) ; also sheet 4
-5.5V: C155.2 C158.- D3.A D4.A ; also sheet 6
GND: C155.1 C156.2 C157.- C158.+ C160.2 C161.- T1.4(SM) ; also sheet 1,2,3,5,6,7,8,9,11,12,13
GNDIO: C151.1 C152.1 C153.1 C154.1 C159.- IC24.7(P:GND) IC27.7(P:GND) Q2.2(S) Q3.2(S) ; also sheet 1,4
N$184: IC27.1(A:I0) IC27.2(A:I1) R157.1
N$185: IC24.4(B:I0) IC24.5(B:I1) IC27.3(A:O)
N$186: C149.1 R157.2 R158.1
N$187: C149.2 IC24.1(A:I0) IC24.2(A:I1) IC24.6(B:O)
N$188: IC24.3(A:O) IC27.4(B:I0) IC27.5(B:I1) IC27.12(D:I0) R158.2 R160.1
N$189: C151.2 IC27.13(D:I1) R160.2
N$190: IC27.6(B:O) IC27.9(C:I0) R159.1
N$191: C152.2 IC27.10(C:I1) R159.2
N$192: IC24.9(C:I0) IC24.10(C:I1) IC27.8(C:O)
N$193: IC24.12(D:I0) IC24.13(D:I1) IC27.11(D:O)
N$194: IC24.11(D:O) R161.1
N$195: IC24.8(C:O) R162.1
N$196: Q3.1(G) R162.2
N$197: D2.A D3.C T1.8(S1P)
N$198: D1.A D4.C T1.7(S1N)
N$199: Q2.3(D) T1.1(P1P)
N$200: Q2.1(G) R161.2
N$201: Q3.3(D) T1.3(P1N)
N$202: D5.A T1.5(S2P)
N$203: D6.A T1.6(S2N)

### Notes on the sheet
- Changed to 82p

## Sheet 11 of 13: Scope Input CH1
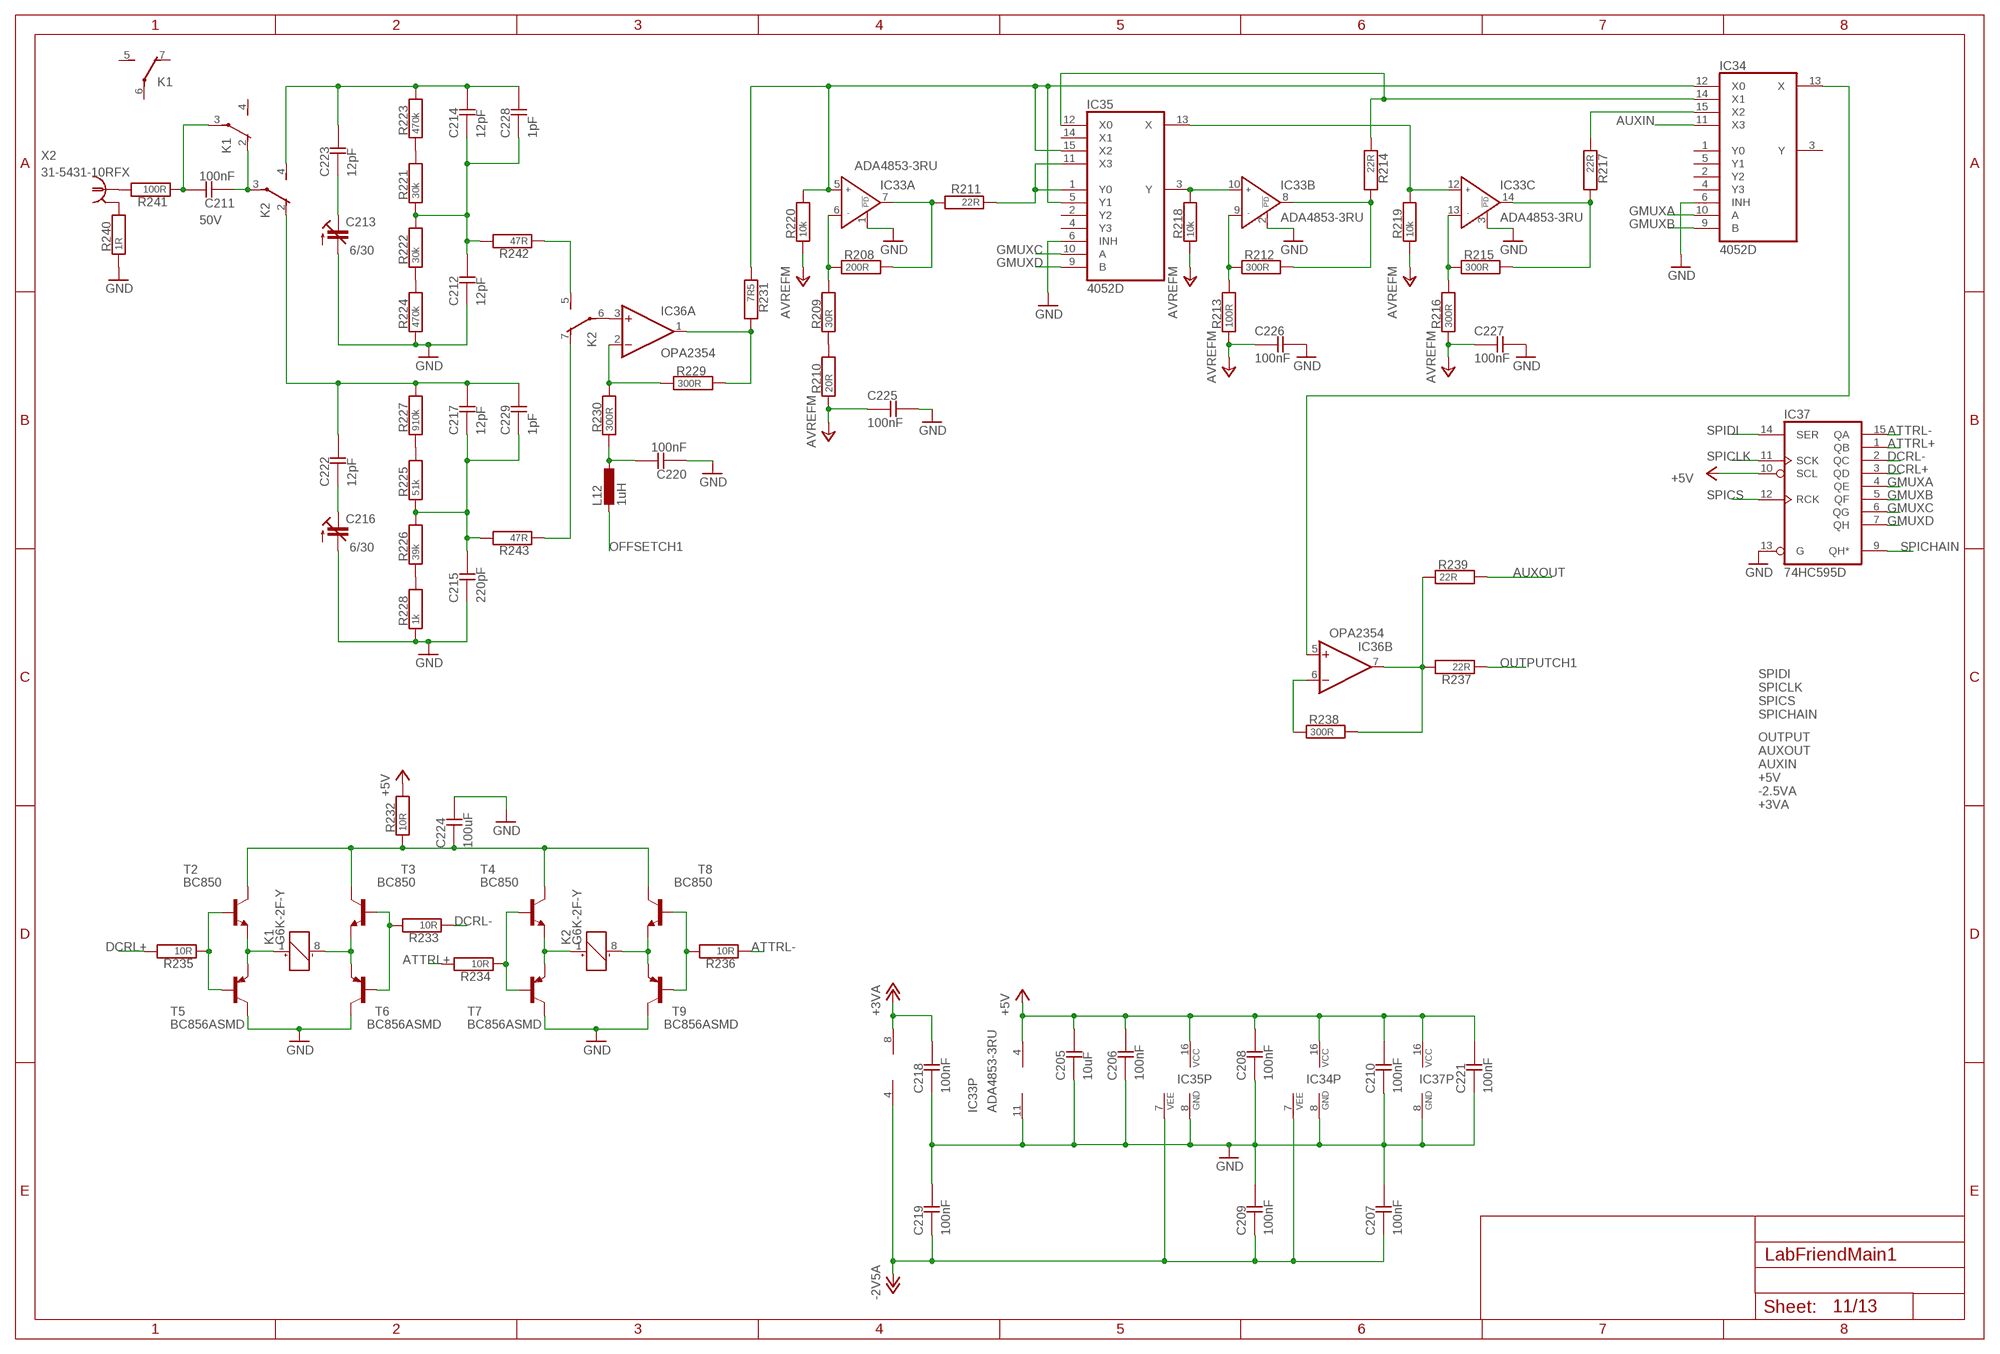
[diagram p10: schematic, sheet 11]

### Parts
C205  10uF  CAPC0603  [0603]
C206  100nF  CAPC0402  [0402]
C207  100nF  CAPC0402  [0402]
C208  100nF  CAPC0402  [0402]
C209  100nF  CAPC0402  [0402]
C210  100nF  CAPC0402  [0402]
C211  100nF  CAPC0603  [0603]
C212  12pF  CAPC0603  [0603]
C213  6/30  C-TRIMMTZBX4  [CTRIMTZBX4]
C214  12pF  CAPC0603  [0603]
C215  220pF  CAPC0603  [0603]
C216  6/30  C-TRIMMTZBX4  [CTRIMTZBX4]
C217  12pF  CAPC0603  [0603]
C218  100nF  CAPC0402  [0402]
C219  100nF  CAPC0402  [0402]
C220  100nF  CAPC0402  [0402]
C221  100nF  CAPC0402  [0402]
C222  12pF  CAPC0603  [0603]
C223  12pF  CAPC0603  [0603]
C224  100uF  CAPC1206  [1206]
C225  100nF  CAPC0402  [0402]
C226  100nF  CAPC0402  [0402]
C227  100nF  CAPC0402  [0402]
C228  1pF  CAPC0603  [0603]
C229  1pF  CAPC0603  [0603]
IC33  ADA4853-3RU  [SO14]
IC34  4052D  [SO16]
IC35  4052D  [SO16]
IC36  OPA2354  AD8682RM  [MSOP08]
IC37  74HC595D  [SO16]
K1  G6K-2F-Y  [G6K-2F-Y]
K2  G6K-2F-Y  [G6K-2F-Y]
L12  1uH  L-EUL3216C  [L3216C]
R208  200R  RESR0603  [0603]
R209  30R  RESR0603  [0603]
R210  20R  RESR0603  [0603]
R211  22R  RESR0603  [0603]
R212  300R  RESR0603  [0603]
R213  100R  RESR0603  [0603]
R214  22R  RESR0603  [0603]
R215  300R  RESR0603  [0603]
R216  300R  RESR0603  [0603]
R217  22R  RESR0603  [0603]
R218  10k  RESR0603  [0603]
R219  10k  RESR0603  [0603]
R220  10k  RESR0603  [0603]
R221  30k  RESR0603  [0603]
R222  30k  RESR0603  [0603]
R223  470k  RESR0603  [0603]
R224  470k  RESR0603  [0603]
R225  51k  RESR0603  [0603]
R226  39k  RESR0603  [0603]
R227  910k  RESR0603  [0603]
R228  1k  RESR0603  [0603]
R229  300R  RESR0603  [0603]
R230  300R  RESR0603  [0603]
R231  7R5  RESR0603  [0603]
R232  10R  RESR0603  [0603]
R233  10R  RESR0603  [0603]
R234  10R  RESR0603  [0603]
R235  10R  RESR0603  [0603]
R236  10R  RESR0603  [0603]
R237  22R  RESR0603  [0603]
R238  300R  RESR0603  [0603]
R239  22R  RESR0603  [0603]
R240  1R  RESR0603  [0603]
R241  100R  RESR0402  [0402]
R242  47R  RESR0603  [0603]
R243  47R  RESR0603  [0603]
T2  BC850  [SOT23]
T3  BC850  [SOT23]
T4  BC850  [SOT23]
T5  BC856ASMD  [SOT23-BEC]
T6  BC856ASMD  [SOT23-BEC]
T7  BC856ASMD  [SOT23-BEC]
T8  BC850  [SOT23]
T9  BC856ASMD  [SOT23-BEC]
X2  31-5431-10RFX  227161-8  [AMP_227161]

### Nets
3V3A: C218.2 IC36.8(P:V+) ; supply symbol labelled +3VA ; also sheet 3,6,7,12
+5V: C205.2 C206.2 C208.2 C210.2 C221.2 IC33.4(P:V+) IC34.16(VCC) IC35.16(VCC) IC37.10(SCL) IC37.16(VCC) R232.2 ; also sheet 6,7,8,9,12,13
-2V5A: C207.1 C209.1 C219.1 IC34.7(VEE) IC35.7(VEE) IC36.4(P:V-) ; also sheet 6,7,12
ATTRL+: IC37.1(QB) R234.2
ATTRL-: IC37.15(QA) R236.1
AUXIN: IC34.11(X3) ; also sheet 12
AUXOUT: R239.2
AVREFM: C225.1 C226.1 C227.1 R210.1 R213.1 R216.1 R218.1 R219.1 R220.1 ; also sheet 7,9,12
DCRL+: IC37.3(QD) R235.2
DCRL-: IC37.2(QC) R233.1
GMUXA: IC34.10(A) IC37.4(QE)
GMUXB: IC34.9(B) IC37.5(QF)
GMUXC: IC35.10(A) IC37.6(QG)
GMUXD: IC35.9(B) IC37.7(QH)
GND: C205.1 C206.1 C207.2 C208.1 C209.2 C210.1 C212.1 C213.2(A) C215.1 C216.2(A) C218.1 C219.2 C220.1 C221.1 C224.2 C225.2 C226.2 C227.2 IC33.1(A:!POWERDOWN) IC33.2(B:!POWERDOWN) IC33.3(C:!POWERDOWN) IC33.11(P:V-) IC34.6(INH) IC34.8(GND) IC35.6(INH) IC35.8(GND) IC37.8(GND) IC37.13(G) R224.1 R228.1 R240.1 T5.C T6.C T7.C T9.C ; also sheet 1,2,3,5,6,7,8,9,10,12,13
N$230: IC33.6(A:IN-) R208.1 R209.2
N$231: IC33.7(A:OUT) R208.2 R211.2
N$232: R209.1 R210.2
N$233: IC33.9(B:IN-) R212.1 R213.2
N$234: IC33.13(C:IN-) R215.1 R216.2
N$235: IC33.14(C:OUT) R215.2 R217.2
N$236: IC33.5(A:IN+) IC34.12(X0) IC35.5(Y1) IC35.15(X2) R220.2 R231.1
N$237: IC33.8(B:OUT) R212.2 R214.2
N$238: IC35.1(Y0) IC35.11(X3) R211.1
N$239: IC33.12(C:IN+) IC35.13(X) R219.2
N$240: IC34.14(X1) IC35.12(X0) R214.1
N$241: IC34.15(X2) R217.1
N$242: IC33.10(B:IN+) IC35.3(Y) R218.2
N$243: C211.2 K1.3(2:P) R241.1
N$244: C211.1 K1.2(2:O) K2.3(2:P)
N$245: R221.2 R223.1
N$246: C212.2 C214.1 C228.1 R221.1 R222.2 R242.2
N$247: R222.1 R224.2
N$248: C214.2 C223.2 C228.2 K2.4(2:S) R223.2
N$249: R225.2 R227.1
N$250: R226.1 R228.2
N$251: C217.2 C222.2 C229.2 K2.2(2:O) R227.2
N$252: IC36.2(A:-IN) R229.1 R230.2
N$253: IC36.1(A:OUT) R229.2 R231.2
N$254: IC34.13(X) IC36.5(B:+IN)
N$255: C224.1 R232.1 T2.3(C) T3.3(C) T4.3(C) T8.3(C)
N$256: K1.8(1:-) T3.2(E) T6.E
N$257: K1.1(1:+) T2.2(E) T5.E
N$258: R235.1 T2.1(B) T5.B
N$259: R233.2 T3.1(B) T6.B
N$260: K2.1(1:+) T4.2(E) T7.E
N$261: K2.8(1:-) T8.2(E) T9.E
N$262: R234.1 T4.1(B) T7.B
N$263: R236.2 T8.1(B) T9.B
N$264: IC36.7(B:OUT) R237.2 R238.2 R239.1
N$265: IC36.3(A:+IN) K2.6(3:P)
N$266: C216.1(E) C222.1
N$267: C213.1(E) C223.1
N$268: IC36.6(B:-IN) R238.1
N$269: C220.2 L12.1 R230.1
N$270: C215.2 C217.1 C229.1 R225.1 R226.2 R243.2
N$271: R240.2 X2.2
N$272: R241.2 X2.1
N$273: K2.5(3:S) R242.1
N$274: K2.7(3:O) R243.1
OFFSETCH1: L12.2 ; also sheet 7
OUTPUTCH1: R237.1 ; also sheet 3
SPICHAIN: IC37.9(QH*) ; also sheet 12
SPICLK: IC37.11(SCK) ; also sheet 1,12
SPICS: IC37.12(RCK) ; also sheet 1,12
SPIDI: IC37.14(SER) ; also sheet 1
Unconnected: IC34.1(Y0) IC34.2(Y2) IC34.3(Y) IC34.4(Y3) IC34.5(Y1) IC35.2(Y2) IC35.4(Y3) IC35.14(X1) K1.4(2:S) K1.5(3:S) K1.6(3:P) K1.7(3:O)

### Notes on the sheet
- SPIDI
  SPICLK
  SPICS
  SPICHAIN
- OUTPUT
  AUXOUT
  AUXIN
  +5V
  -2.5VA
  +3VA